# EAGLE design light-plate_all_v1.0 (EAGLE 6.2)

## Sheet 1 of 4
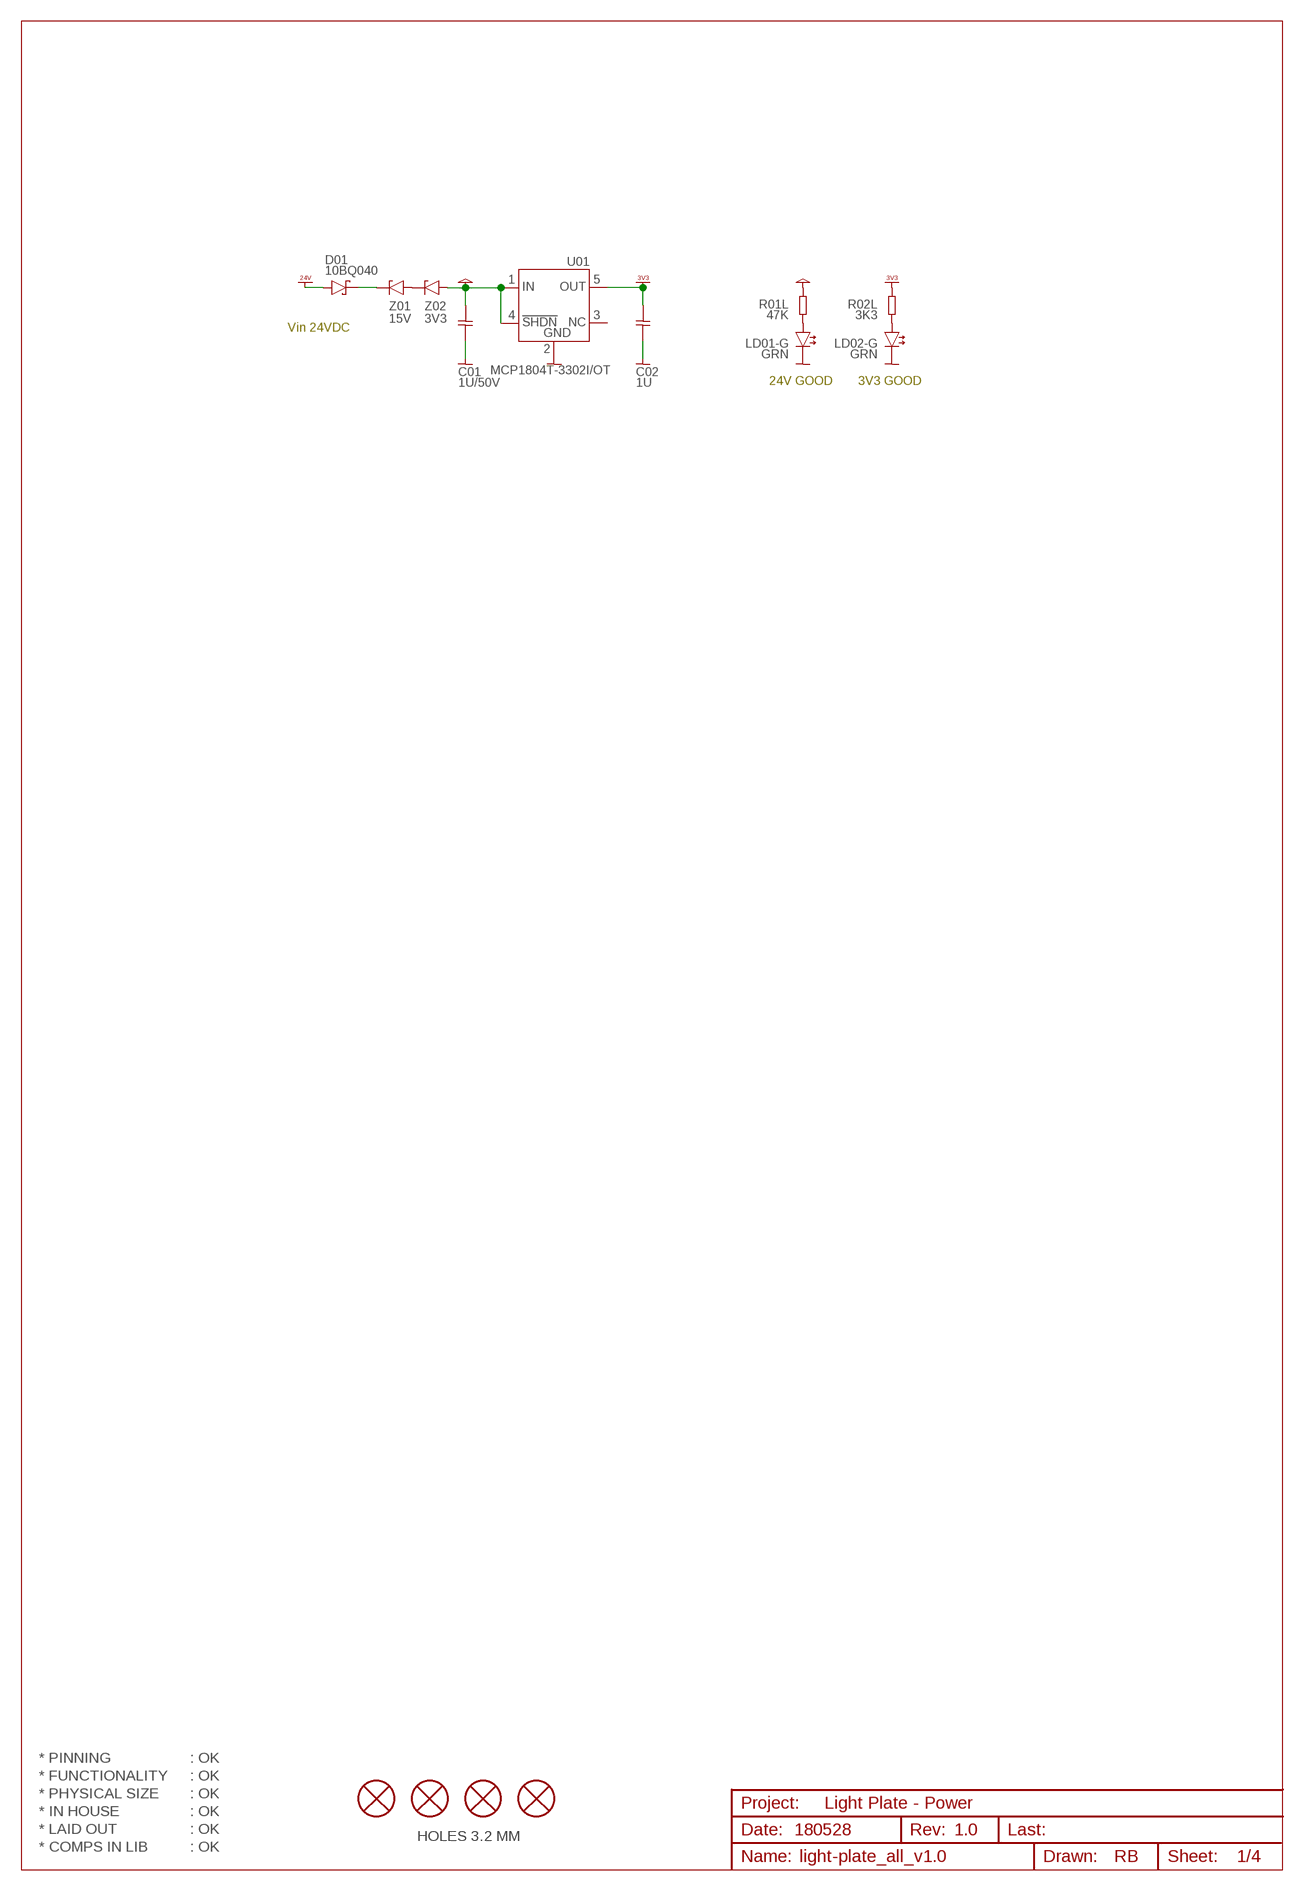
[diagram p0: schematic, sheet 1]

### Parts
C01  1U/50V  CAP0603  [CAP0603]
C02  1U  CAP0603  [CAP0603]
D01  10BQ040  DIODE_15MQ040  [DIODE_SMA]
H1  HOLE_3.2MM  [HOLE_PTH_3.2MM]
H2  HOLE_3.2MM  [HOLE_PTH_3.2MM]
H3  HOLE_3.2MM  [HOLE_PTH_3.2MM]
H4  HOLE_3.2MM  [HOLE_PTH_3.2MM]
LD01-G  GRN  LED_SMD_0603  [LED_SMD_0603]
LD02-G  GRN  LED_SMD_0603  [LED_SMD_0603]
R01L  47K  RES0603  [RES0603]
R02L  3K3  RES0603  [RES0603]
U01  MCP1804T-3302I/OT  [SOT23-5]
Z01  15V  ZENER_SOD80  [ZENER_SOD80]
Z02  3V3  ZENER_SOD80  [ZENER_SOD80]

### Nets
GND: C01.2 C02.2 LD01-G.C LD02-G.C U01.2(2.GND) ; also sheet 2,3,4
N$3: LD02-G.A R02L.2
N$25: LD01-G.A R01L.2
N$151: D01.C(-) Z01.2(-)
N$162: Z01.1(+) Z02.2(-)
VCC: C01.1 R01L.1 U01.1(1.IN) U01.4(4.SHDN) Z02.1(+)
VDD_3V3: C02.1 R02L.1 U01.5(5.OUT) ; supply symbol labelled VCC_3V3 ; also sheet 2
VDD_24V: D01.A(+) ; supply symbol labelled VCC_24V ; also sheet 2,3,4
Unconnected: H1.1 H2.1 H3.1 H4.1 U01.3(3.NC)

### Notes on the sheet
- Vin 24VDC
- 24V GOOD | 3V3 GOOD
- * PINNING | : OK
- * FUNCTIONALITY | : OK
- * PHYSICAL SIZE | : OK
- Light Plate - Power
- * IN HOUSE | : OK
- * LAID OUT | : OK | 180528 | 1.0
- HOLES 3.2 MM
- * COMPS IN LIB | : OK

## Sheet 2 of 4
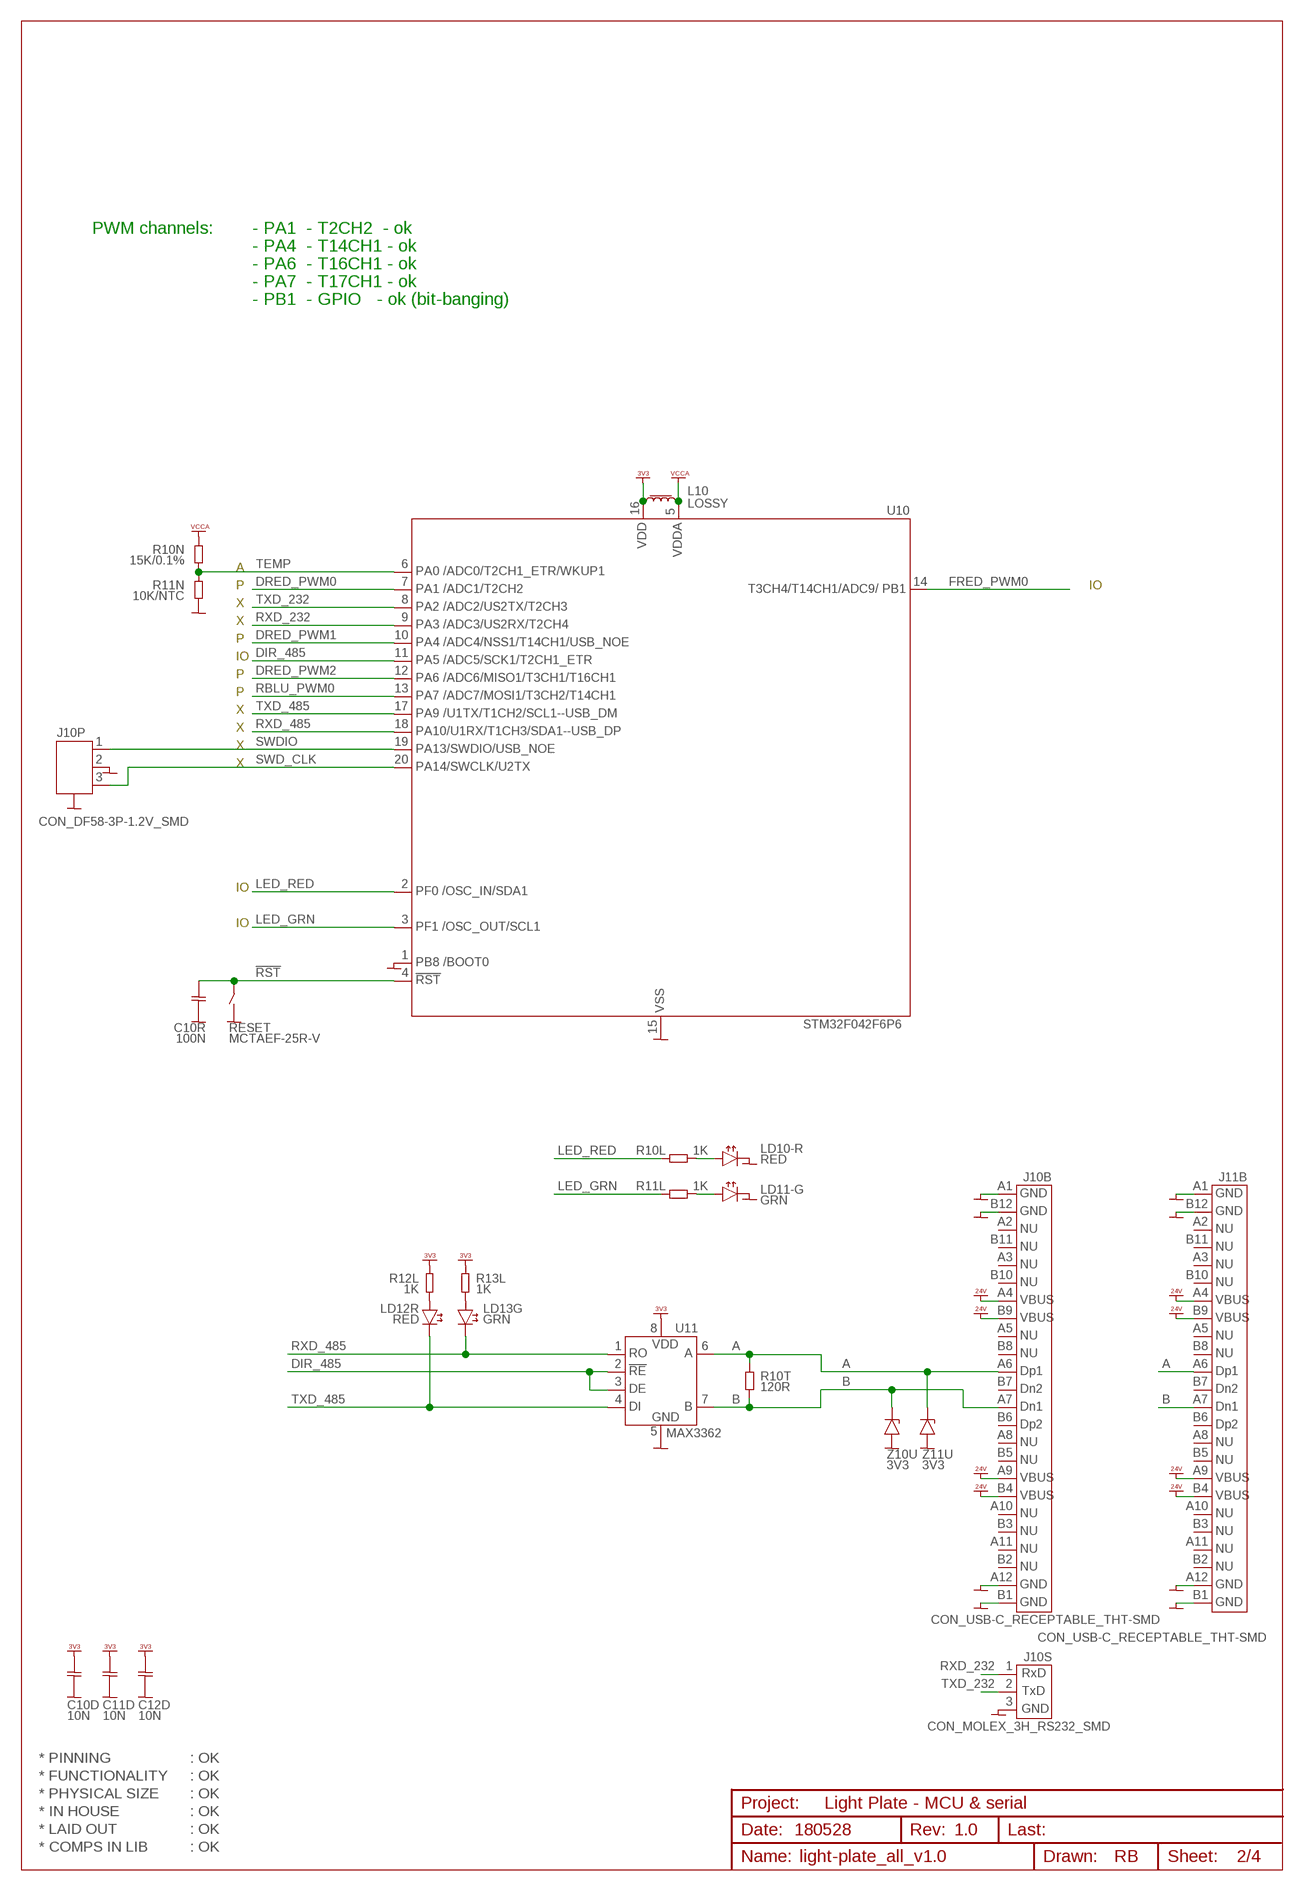
[diagram p1: schematic, sheet 2]

### Parts
C10D  10N  CAP0603  [CAP0603]
C10R  100N  CAP0603  [CAP0603]
C11D  10N  CAP0603  [CAP0603]
C12D  10N  CAP0603  [CAP0603]
J10B  CON_USB-C_RECEPTABLE_THT-SMD  [CON_USB-C_RECEPTABLE_THT-SMD]
J10P  CON_DF58-3P-1.2V_SMD  [CON_DF58-3P-1.2V_SMD]
J10S  CON_MOLEX_3H_RS232_SMD  [CON_MOLEX_3H+SMD]
J11B  CON_USB-C_RECEPTABLE_THT-SMD  [CON_USB-C_RECEPTABLE_THT-SMD]
L10  LOSSY  L_0603  [L_0603]
LD10-R  RED  LED_SMD_0603  [LED_SMD_0603]
LD11-G  GRN  LED_SMD_0603  [LED_SMD_0603]
LD12R  RED  LED_SMD_0603  [LED_SMD_0603]
LD13G  GRN  LED_SMD_0603  [LED_SMD_0603]
R10L  1K  RES0603  [RES0603]
R10N  15K/0.1%  RES0603  [RES0603]
R10T  120R  RES0603  [RES0603]
R11L  1K  RES0603  [RES0603]
R11N  10K/NTC  RES0603  [RES0603]
R12L  1K  RES0603  [RES0603]
R13L  1K  RES0603  [RES0603]
RESET  MCTAEF-25R-V  SWITCH_PUSHBUTTON  [SWITCH_SMD_PBUTTON_2P]
U10  STM32F042F6P6  [TSSOP20]
U11  MAX3362  [SOT23-8]
Z10U  3V3  ZENER_SOD80  [ZENER_SOD80]
Z11U  3V3  ZENER_SOD80  [ZENER_SOD80]

### Nets
!RST: C10R.1 RESET.2(3-4) U10.4(4.!RST)
A: J10B.A6(A6.DP1) J11B.A6(A6.DP1) R10T.1 U11.6(6.A) Z11U.2(-)
B: J10B.A7(A7.DN1) J11B.A7(A7.DN1) R10T.2 U11.7(7.B) Z10U.2(-)
DIR_485: U10.11(11.PA5) U11.2(2.!RE) U11.3(3.DE)
DRED_PWM0: U10.7(7.PA1) ; also sheet 3
DRED_PWM1: U10.10(10.PA4) ; also sheet 3
DRED_PWM2: U10.12(12.PA6) ; also sheet 3
FRED_PWM0: U10.14(14.PB1) ; also sheet 4
GND: C10D.2 C10R.2 C11D.2 C12D.2 J10B.A1(A1.GND) J10B.A12(A12.GND) J10B.B1(B1.GND) J10B.B12(B12.GND) J10P.2 J10P.GND1 J10P.GND2 J10S.3 J11B.A1(A1.GND) J11B.A12(A12.GND) J11B.B1(B1.GND) J11B.B12(B12.GND) LD10-R.C LD11-G.C R11N.1 RESET.1(1-2) U10.1(1.BOOT0) U10.15(15.GND) U11.5(5.GND) Z10U.1(+) Z11U.1(+) ; also sheet 1,3,4
LED_GRN: R11L.1 U10.3(3.OSC_OUT)
LED_RED: R10L.1 U10.2(2.OSC_IN)
N$148: LD11-G.A R11L.2
N$149: LD10-R.A R10L.2
N$152: LD13G.A R13L.2
N$153: LD12R.A R12L.2
RBLU_PWM0: U10.13(13.PA7) ; also sheet 4
RXD_232: J10S.1 U10.9(9.PA3)
RXD_485: LD13G.C U10.18(18.PA10) U11.1(1.RO)
SWD_CLK: J10P.3 U10.20(20.PA14)
SWDIO: J10P.1 U10.19(19.PA13)
TEMP: R10N.1 R11N.2 U10.6(6.PA0)
TXD_232: J10S.2 U10.8(8.PA2)
TXD_485: LD12R.C U10.17(17.PA9) U11.4(4.DI)
VCCA: L10.2 R10N.2 U10.5(5.VDDA)
VDD_3V3: C10D.1 C11D.1 C12D.1 L10.1 R12L.1 R13L.1 U10.16(16.VDD) U11.8(8.VDD) ; supply symbol labelled VCC_3V3 ; also sheet 1
VDD_24V: J10B.A4(A4.VBUS) J10B.A9(A9.VBUS) J10B.B4(B4.VBUS) J10B.B9(B9.VBUS) J11B.A4(A4.VBUS) J11B.A9(A9.VBUS) J11B.B4(B4.VBUS) J11B.B9(B9.VBUS) ; supply symbol labelled VCC_24V ; also sheet 1,3,4
Unconnected: J10B.A2(A2.NU) J10B.A3(A3.NU) J10B.A5(A5.NU) J10B.A8(A8.NU) J10B.A10(A10.NU) J10B.A11(A11.NU) J10B.B2(B2.NU) J10B.B3(B3.NU) J10B.B5(B5.NU) J10B.B6(B6.DP2) J10B.B7(B7.DN2) J10B.B8(B8.NU) J10B.B10(B10.NU) J10B.B11(B11.NU) J11B.A2(A2.NU) J11B.A3(A3.NU) J11B.A5(A5.NU) J11B.A8(A8.NU) J11B.A10(A10.NU) J11B.A11(A11.NU) J11B.B2(B2.NU) J11B.B3(B3.NU) J11B.B5(B5.NU) J11B.B6(B6.DP2) J11B.B7(B7.DN2) J11B.B8(B8.NU) J11B.B10(B10.NU) J11B.B11(B11.NU)

### Notes on the sheet
- PWM channels: | - PA1  - T2CH2  - ok
- - PA4  - T14CH1 - ok
- - PA6  - T16CH1 - ok
- - PA7  - T17CH1 - ok
- - PB1  - GPIO   - ok (bit-banging)
- A
- P | IO
- X
- X
- P
- IO
- P
- P
- X
- X
- X
- X
- IO
- IO
- * PINNING | : OK
- * FUNCTIONALITY | : OK
- * PHYSICAL SIZE | : OK
- Light Plate - MCU & serial
- * IN HOUSE | : OK
- * LAID OUT | : OK | 180528 | 1.0
- * COMPS IN LIB | : OK

## Sheet 3 of 4
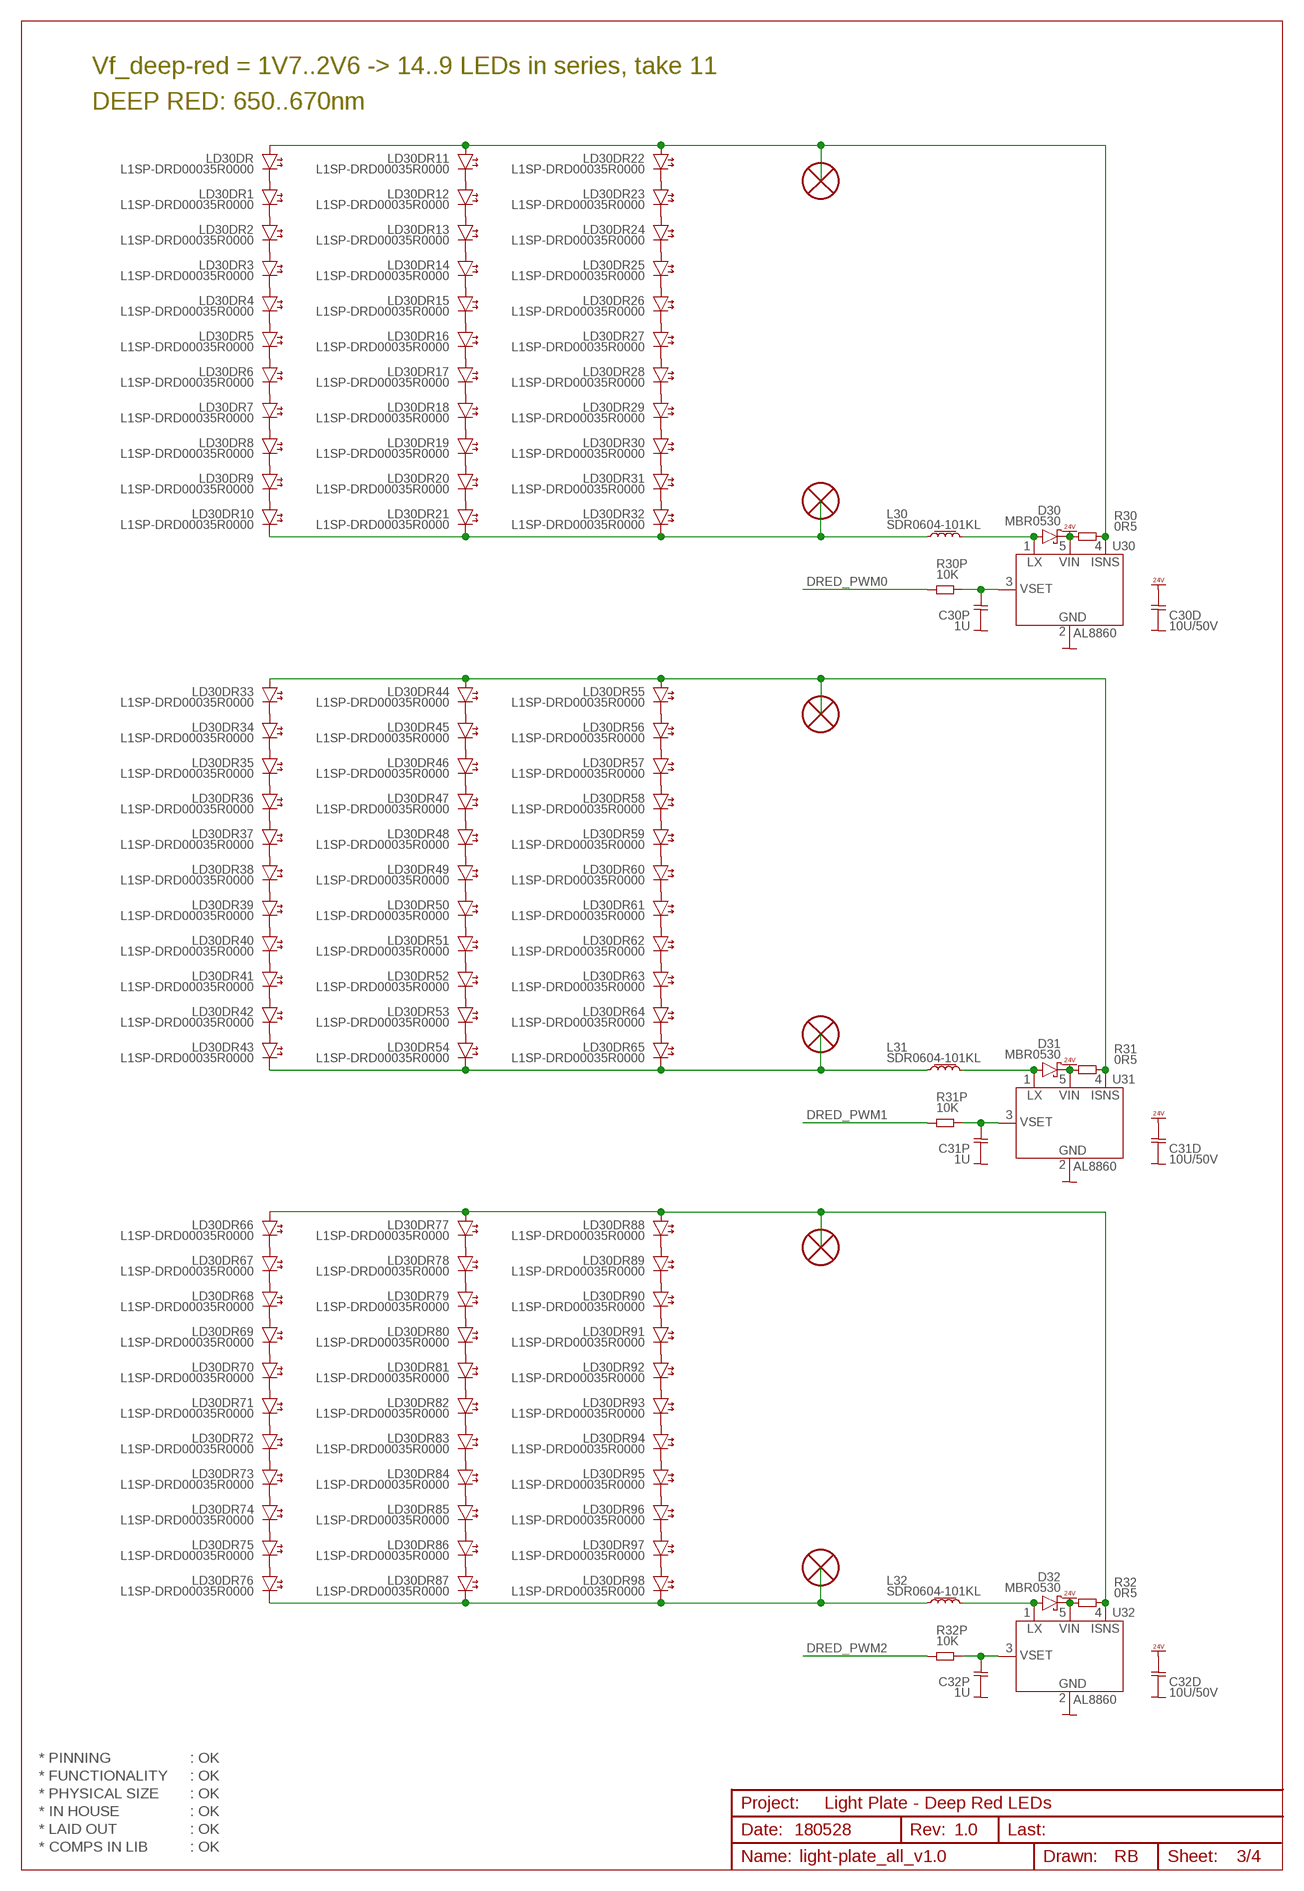
[diagram p2: schematic, sheet 3]

### Parts
C30D  10U/50V  CAP0603  [CAP0603]
C30P  1U  CAP0603  [CAP0603]
C31D  10U/50V  CAP0603  [CAP0603]
C31P  1U  CAP0603  [CAP0603]
C32D  10U/50V  CAP0603  [CAP0603]
C32P  1U  CAP0603  [CAP0603]
D30  MBR0530  DIODE_MBR0530  [DIODE_SOD123]
D31  MBR0530  DIODE_MBR0530  [DIODE_SOD123]
D32  MBR0530  DIODE_MBR0530  [DIODE_SOD123]
H5  HOLE_PTH_1.0MM  [HOLE_PTH_1.0MM]
H6  HOLE_PTH_1.0MM  [HOLE_PTH_1.0MM]
H7  HOLE_PTH_1.0MM  [HOLE_PTH_1.0MM]
H8  HOLE_PTH_1.0MM  [HOLE_PTH_1.0MM]
H9  HOLE_PTH_1.0MM  [HOLE_PTH_1.0MM]
H10  HOLE_PTH_1.0MM  [HOLE_PTH_1.0MM]
L30  SDR0604-101KL  L_SDR0604  [L_SDR0604]
L31  SDR0604-101KL  L_SDR0604  [L_SDR0604]
L32  SDR0604-101KL  L_SDR0604  [L_SDR0604]
LD30DR  L1SP-DRD00035R0000  LED_SMD_SUNPLUS35_REVERSED  [LED_SMD_SUNPLUS35_REVERSED]
LD30DR1  L1SP-DRD00035R0000  LED_SMD_SUNPLUS35_REVERSED  [LED_SMD_SUNPLUS35_REVERSED]
LD30DR2  L1SP-DRD00035R0000  LED_SMD_SUNPLUS35_REVERSED  [LED_SMD_SUNPLUS35_REVERSED]
LD30DR3  L1SP-DRD00035R0000  LED_SMD_SUNPLUS35_REVERSED  [LED_SMD_SUNPLUS35_REVERSED]
LD30DR4  L1SP-DRD00035R0000  LED_SMD_SUNPLUS35_REVERSED  [LED_SMD_SUNPLUS35_REVERSED]
LD30DR5  L1SP-DRD00035R0000  LED_SMD_SUNPLUS35_REVERSED  [LED_SMD_SUNPLUS35_REVERSED]
LD30DR6  L1SP-DRD00035R0000  LED_SMD_SUNPLUS35_REVERSED  [LED_SMD_SUNPLUS35_REVERSED]
LD30DR7  L1SP-DRD00035R0000  LED_SMD_SUNPLUS35_REVERSED  [LED_SMD_SUNPLUS35_REVERSED]
LD30DR8  L1SP-DRD00035R0000  LED_SMD_SUNPLUS35_REVERSED  [LED_SMD_SUNPLUS35_REVERSED]
LD30DR9  L1SP-DRD00035R0000  LED_SMD_SUNPLUS35_REVERSED  [LED_SMD_SUNPLUS35_REVERSED]
LD30DR10  L1SP-DRD00035R0000  LED_SMD_SUNPLUS35_REVERSED  [LED_SMD_SUNPLUS35_REVERSED]
LD30DR11  L1SP-DRD00035R0000  LED_SMD_SUNPLUS35_REVERSED  [LED_SMD_SUNPLUS35_REVERSED]
LD30DR12  L1SP-DRD00035R0000  LED_SMD_SUNPLUS35_REVERSED  [LED_SMD_SUNPLUS35_REVERSED]
LD30DR13  L1SP-DRD00035R0000  LED_SMD_SUNPLUS35_REVERSED  [LED_SMD_SUNPLUS35_REVERSED]
LD30DR14  L1SP-DRD00035R0000  LED_SMD_SUNPLUS35_REVERSED  [LED_SMD_SUNPLUS35_REVERSED]
LD30DR15  L1SP-DRD00035R0000  LED_SMD_SUNPLUS35_REVERSED  [LED_SMD_SUNPLUS35_REVERSED]
LD30DR16  L1SP-DRD00035R0000  LED_SMD_SUNPLUS35_REVERSED  [LED_SMD_SUNPLUS35_REVERSED]
LD30DR17  L1SP-DRD00035R0000  LED_SMD_SUNPLUS35_REVERSED  [LED_SMD_SUNPLUS35_REVERSED]
LD30DR18  L1SP-DRD00035R0000  LED_SMD_SUNPLUS35_REVERSED  [LED_SMD_SUNPLUS35_REVERSED]
LD30DR19  L1SP-DRD00035R0000  LED_SMD_SUNPLUS35_REVERSED  [LED_SMD_SUNPLUS35_REVERSED]
LD30DR20  L1SP-DRD00035R0000  LED_SMD_SUNPLUS35_REVERSED  [LED_SMD_SUNPLUS35_REVERSED]
LD30DR21  L1SP-DRD00035R0000  LED_SMD_SUNPLUS35_REVERSED  [LED_SMD_SUNPLUS35_REVERSED]
LD30DR22  L1SP-DRD00035R0000  LED_SMD_SUNPLUS35_REVERSED  [LED_SMD_SUNPLUS35_REVERSED]
LD30DR23  L1SP-DRD00035R0000  LED_SMD_SUNPLUS35_REVERSED  [LED_SMD_SUNPLUS35_REVERSED]
LD30DR24  L1SP-DRD00035R0000  LED_SMD_SUNPLUS35_REVERSED  [LED_SMD_SUNPLUS35_REVERSED]
LD30DR25  L1SP-DRD00035R0000  LED_SMD_SUNPLUS35_REVERSED  [LED_SMD_SUNPLUS35_REVERSED]
LD30DR26  L1SP-DRD00035R0000  LED_SMD_SUNPLUS35_REVERSED  [LED_SMD_SUNPLUS35_REVERSED]
LD30DR27  L1SP-DRD00035R0000  LED_SMD_SUNPLUS35_REVERSED  [LED_SMD_SUNPLUS35_REVERSED]
LD30DR28  L1SP-DRD00035R0000  LED_SMD_SUNPLUS35_REVERSED  [LED_SMD_SUNPLUS35_REVERSED]
LD30DR29  L1SP-DRD00035R0000  LED_SMD_SUNPLUS35_REVERSED  [LED_SMD_SUNPLUS35_REVERSED]
LD30DR30  L1SP-DRD00035R0000  LED_SMD_SUNPLUS35_REVERSED  [LED_SMD_SUNPLUS35_REVERSED]
LD30DR31  L1SP-DRD00035R0000  LED_SMD_SUNPLUS35_REVERSED  [LED_SMD_SUNPLUS35_REVERSED]
LD30DR32  L1SP-DRD00035R0000  LED_SMD_SUNPLUS35_REVERSED  [LED_SMD_SUNPLUS35_REVERSED]
LD30DR33  L1SP-DRD00035R0000  LED_SMD_SUNPLUS35_REVERSED  [LED_SMD_SUNPLUS35_REVERSED]
LD30DR34  L1SP-DRD00035R0000  LED_SMD_SUNPLUS35_REVERSED  [LED_SMD_SUNPLUS35_REVERSED]
LD30DR35  L1SP-DRD00035R0000  LED_SMD_SUNPLUS35_REVERSED  [LED_SMD_SUNPLUS35_REVERSED]
LD30DR36  L1SP-DRD00035R0000  LED_SMD_SUNPLUS35_REVERSED  [LED_SMD_SUNPLUS35_REVERSED]
LD30DR37  L1SP-DRD00035R0000  LED_SMD_SUNPLUS35_REVERSED  [LED_SMD_SUNPLUS35_REVERSED]
LD30DR38  L1SP-DRD00035R0000  LED_SMD_SUNPLUS35_REVERSED  [LED_SMD_SUNPLUS35_REVERSED]
LD30DR39  L1SP-DRD00035R0000  LED_SMD_SUNPLUS35_REVERSED  [LED_SMD_SUNPLUS35_REVERSED]
LD30DR40  L1SP-DRD00035R0000  LED_SMD_SUNPLUS35_REVERSED  [LED_SMD_SUNPLUS35_REVERSED]
LD30DR41  L1SP-DRD00035R0000  LED_SMD_SUNPLUS35_REVERSED  [LED_SMD_SUNPLUS35_REVERSED]
LD30DR42  L1SP-DRD00035R0000  LED_SMD_SUNPLUS35_REVERSED  [LED_SMD_SUNPLUS35_REVERSED]
LD30DR43  L1SP-DRD00035R0000  LED_SMD_SUNPLUS35_REVERSED  [LED_SMD_SUNPLUS35_REVERSED]
LD30DR44  L1SP-DRD00035R0000  LED_SMD_SUNPLUS35_REVERSED  [LED_SMD_SUNPLUS35_REVERSED]
LD30DR45  L1SP-DRD00035R0000  LED_SMD_SUNPLUS35_REVERSED  [LED_SMD_SUNPLUS35_REVERSED]
LD30DR46  L1SP-DRD00035R0000  LED_SMD_SUNPLUS35_REVERSED  [LED_SMD_SUNPLUS35_REVERSED]
LD30DR47  L1SP-DRD00035R0000  LED_SMD_SUNPLUS35_REVERSED  [LED_SMD_SUNPLUS35_REVERSED]
LD30DR48  L1SP-DRD00035R0000  LED_SMD_SUNPLUS35_REVERSED  [LED_SMD_SUNPLUS35_REVERSED]
LD30DR49  L1SP-DRD00035R0000  LED_SMD_SUNPLUS35_REVERSED  [LED_SMD_SUNPLUS35_REVERSED]
LD30DR50  L1SP-DRD00035R0000  LED_SMD_SUNPLUS35_REVERSED  [LED_SMD_SUNPLUS35_REVERSED]
LD30DR51  L1SP-DRD00035R0000  LED_SMD_SUNPLUS35_REVERSED  [LED_SMD_SUNPLUS35_REVERSED]
LD30DR52  L1SP-DRD00035R0000  LED_SMD_SUNPLUS35_REVERSED  [LED_SMD_SUNPLUS35_REVERSED]
LD30DR53  L1SP-DRD00035R0000  LED_SMD_SUNPLUS35_REVERSED  [LED_SMD_SUNPLUS35_REVERSED]
LD30DR54  L1SP-DRD00035R0000  LED_SMD_SUNPLUS35_REVERSED  [LED_SMD_SUNPLUS35_REVERSED]
LD30DR55  L1SP-DRD00035R0000  LED_SMD_SUNPLUS35_REVERSED  [LED_SMD_SUNPLUS35_REVERSED]
LD30DR56  L1SP-DRD00035R0000  LED_SMD_SUNPLUS35_REVERSED  [LED_SMD_SUNPLUS35_REVERSED]
LD30DR57  L1SP-DRD00035R0000  LED_SMD_SUNPLUS35_REVERSED  [LED_SMD_SUNPLUS35_REVERSED]
LD30DR58  L1SP-DRD00035R0000  LED_SMD_SUNPLUS35_REVERSED  [LED_SMD_SUNPLUS35_REVERSED]
LD30DR59  L1SP-DRD00035R0000  LED_SMD_SUNPLUS35_REVERSED  [LED_SMD_SUNPLUS35_REVERSED]
LD30DR60  L1SP-DRD00035R0000  LED_SMD_SUNPLUS35_REVERSED  [LED_SMD_SUNPLUS35_REVERSED]
LD30DR61  L1SP-DRD00035R0000  LED_SMD_SUNPLUS35_REVERSED  [LED_SMD_SUNPLUS35_REVERSED]
LD30DR62  L1SP-DRD00035R0000  LED_SMD_SUNPLUS35_REVERSED  [LED_SMD_SUNPLUS35_REVERSED]
LD30DR63  L1SP-DRD00035R0000  LED_SMD_SUNPLUS35_REVERSED  [LED_SMD_SUNPLUS35_REVERSED]
LD30DR64  L1SP-DRD00035R0000  LED_SMD_SUNPLUS35_REVERSED  [LED_SMD_SUNPLUS35_REVERSED]
LD30DR65  L1SP-DRD00035R0000  LED_SMD_SUNPLUS35_REVERSED  [LED_SMD_SUNPLUS35_REVERSED]
LD30DR66  L1SP-DRD00035R0000  LED_SMD_SUNPLUS35_REVERSED  [LED_SMD_SUNPLUS35_REVERSED]
LD30DR67  L1SP-DRD00035R0000  LED_SMD_SUNPLUS35_REVERSED  [LED_SMD_SUNPLUS35_REVERSED]
LD30DR68  L1SP-DRD00035R0000  LED_SMD_SUNPLUS35_REVERSED  [LED_SMD_SUNPLUS35_REVERSED]
LD30DR69  L1SP-DRD00035R0000  LED_SMD_SUNPLUS35_REVERSED  [LED_SMD_SUNPLUS35_REVERSED]
LD30DR70  L1SP-DRD00035R0000  LED_SMD_SUNPLUS35_REVERSED  [LED_SMD_SUNPLUS35_REVERSED]
LD30DR71  L1SP-DRD00035R0000  LED_SMD_SUNPLUS35_REVERSED  [LED_SMD_SUNPLUS35_REVERSED]
LD30DR72  L1SP-DRD00035R0000  LED_SMD_SUNPLUS35_REVERSED  [LED_SMD_SUNPLUS35_REVERSED]
LD30DR73  L1SP-DRD00035R0000  LED_SMD_SUNPLUS35_REVERSED  [LED_SMD_SUNPLUS35_REVERSED]
LD30DR74  L1SP-DRD00035R0000  LED_SMD_SUNPLUS35_REVERSED  [LED_SMD_SUNPLUS35_REVERSED]
LD30DR75  L1SP-DRD00035R0000  LED_SMD_SUNPLUS35_REVERSED  [LED_SMD_SUNPLUS35_REVERSED]
LD30DR76  L1SP-DRD00035R0000  LED_SMD_SUNPLUS35_REVERSED  [LED_SMD_SUNPLUS35_REVERSED]
LD30DR77  L1SP-DRD00035R0000  LED_SMD_SUNPLUS35_REVERSED  [LED_SMD_SUNPLUS35_REVERSED]
LD30DR78  L1SP-DRD00035R0000  LED_SMD_SUNPLUS35_REVERSED  [LED_SMD_SUNPLUS35_REVERSED]
LD30DR79  L1SP-DRD00035R0000  LED_SMD_SUNPLUS35_REVERSED  [LED_SMD_SUNPLUS35_REVERSED]
LD30DR80  L1SP-DRD00035R0000  LED_SMD_SUNPLUS35_REVERSED  [LED_SMD_SUNPLUS35_REVERSED]
LD30DR81  L1SP-DRD00035R0000  LED_SMD_SUNPLUS35_REVERSED  [LED_SMD_SUNPLUS35_REVERSED]
LD30DR82  L1SP-DRD00035R0000  LED_SMD_SUNPLUS35_REVERSED  [LED_SMD_SUNPLUS35_REVERSED]
LD30DR83  L1SP-DRD00035R0000  LED_SMD_SUNPLUS35_REVERSED  [LED_SMD_SUNPLUS35_REVERSED]
LD30DR84  L1SP-DRD00035R0000  LED_SMD_SUNPLUS35_REVERSED  [LED_SMD_SUNPLUS35_REVERSED]
LD30DR85  L1SP-DRD00035R0000  LED_SMD_SUNPLUS35_REVERSED  [LED_SMD_SUNPLUS35_REVERSED]
LD30DR86  L1SP-DRD00035R0000  LED_SMD_SUNPLUS35_REVERSED  [LED_SMD_SUNPLUS35_REVERSED]
LD30DR87  L1SP-DRD00035R0000  LED_SMD_SUNPLUS35_REVERSED  [LED_SMD_SUNPLUS35_REVERSED]
LD30DR88  L1SP-DRD00035R0000  LED_SMD_SUNPLUS35_REVERSED  [LED_SMD_SUNPLUS35_REVERSED]
LD30DR89  L1SP-DRD00035R0000  LED_SMD_SUNPLUS35_REVERSED  [LED_SMD_SUNPLUS35_REVERSED]
LD30DR90  L1SP-DRD00035R0000  LED_SMD_SUNPLUS35_REVERSED  [LED_SMD_SUNPLUS35_REVERSED]
LD30DR91  L1SP-DRD00035R0000  LED_SMD_SUNPLUS35_REVERSED  [LED_SMD_SUNPLUS35_REVERSED]
LD30DR92  L1SP-DRD00035R0000  LED_SMD_SUNPLUS35_REVERSED  [LED_SMD_SUNPLUS35_REVERSED]
LD30DR93  L1SP-DRD00035R0000  LED_SMD_SUNPLUS35_REVERSED  [LED_SMD_SUNPLUS35_REVERSED]
LD30DR94  L1SP-DRD00035R0000  LED_SMD_SUNPLUS35_REVERSED  [LED_SMD_SUNPLUS35_REVERSED]
LD30DR95  L1SP-DRD00035R0000  LED_SMD_SUNPLUS35_REVERSED  [LED_SMD_SUNPLUS35_REVERSED]
LD30DR96  L1SP-DRD00035R0000  LED_SMD_SUNPLUS35_REVERSED  [LED_SMD_SUNPLUS35_REVERSED]
LD30DR97  L1SP-DRD00035R0000  LED_SMD_SUNPLUS35_REVERSED  [LED_SMD_SUNPLUS35_REVERSED]
LD30DR98  L1SP-DRD00035R0000  LED_SMD_SUNPLUS35_REVERSED  [LED_SMD_SUNPLUS35_REVERSED]
R30  0R5  RES0603  [RES0603]
R30P  10K  RES0603  [RES0603]
R31  0R5  RES0603  [RES0603]
R31P  10K  RES0603  [RES0603]
R32  0R5  RES0603  [RES0603]
R32P  10K  RES0603  [RES0603]
U30  AL8860  [SOT23-5]
U31  AL8860  [SOT23-5]
U32  AL8860  [SOT23-5]

### Nets
DRED_PWM0: R30P.1 ; also sheet 2
DRED_PWM1: R31P.1 ; also sheet 2
DRED_PWM2: R32P.1 ; also sheet 2
GND: C30D.2 C30P.2 C31D.2 C31P.2 C32D.2 C32P.2 U30.2(2.GND) U31.2(2.GND) U32.2(2.GND) ; also sheet 1,2,4
N$12: C30P.1 R30P.2 U30.3(3.VSET)
N$15: LD30DR1.C(+) LD30DR.A(-)
N$16: LD30DR1.A(-) LD30DR2.C(+)
N$17: LD30DR2.A(-) LD30DR3.C(+)
N$18: LD30DR3.A(-) LD30DR4.C(+)
N$19: LD30DR4.A(-) LD30DR5.C(+)
N$20: LD30DR5.A(-) LD30DR6.C(+)
N$21: LD30DR6.A(-) LD30DR7.C(+)
N$22: LD30DR7.A(-) LD30DR8.C(+)
N$23: LD30DR8.A(-) LD30DR9.C(+)
N$24: LD30DR9.A(-) LD30DR10.C(+)
N$26: LD30DR11.A(-) LD30DR12.C(+)
N$27: LD30DR12.A(-) LD30DR13.C(+)
N$28: LD30DR13.A(-) LD30DR14.C(+)
N$29: LD30DR14.A(-) LD30DR15.C(+)
N$30: LD30DR15.A(-) LD30DR16.C(+)
N$31: LD30DR16.A(-) LD30DR17.C(+)
N$32: LD30DR17.A(-) LD30DR18.C(+)
N$33: LD30DR18.A(-) LD30DR19.C(+)
N$34: LD30DR19.A(-) LD30DR20.C(+)
N$35: LD30DR20.A(-) LD30DR21.C(+)
N$36: LD30DR22.A(-) LD30DR23.C(+)
N$37: LD30DR23.A(-) LD30DR24.C(+)
N$38: LD30DR24.A(-) LD30DR25.C(+)
N$39: LD30DR25.A(-) LD30DR26.C(+)
N$40: LD30DR26.A(-) LD30DR27.C(+)
N$41: LD30DR27.A(-) LD30DR28.C(+)
N$42: LD30DR28.A(-) LD30DR29.C(+)
N$43: LD30DR29.A(-) LD30DR30.C(+)
N$44: LD30DR30.A(-) LD30DR31.C(+)
N$45: LD30DR31.A(-) LD30DR32.C(+)
N$46: LD30DR33.A(-) LD30DR34.C(+)
N$47: LD30DR34.A(-) LD30DR35.C(+)
N$48: LD30DR35.A(-) LD30DR36.C(+)
N$49: LD30DR36.A(-) LD30DR37.C(+)
N$50: LD30DR37.A(-) LD30DR38.C(+)
N$51: LD30DR38.A(-) LD30DR39.C(+)
N$52: LD30DR39.A(-) LD30DR40.C(+)
N$53: LD30DR40.A(-) LD30DR41.C(+)
N$54: LD30DR41.A(-) LD30DR42.C(+)
N$55: LD30DR42.A(-) LD30DR43.C(+)
N$56: LD30DR44.A(-) LD30DR45.C(+)
N$57: LD30DR45.A(-) LD30DR46.C(+)
N$58: LD30DR46.A(-) LD30DR47.C(+)
N$59: LD30DR47.A(-) LD30DR48.C(+)
N$60: LD30DR48.A(-) LD30DR49.C(+)
N$61: LD30DR49.A(-) LD30DR50.C(+)
N$62: LD30DR50.A(-) LD30DR51.C(+)
N$63: LD30DR51.A(-) LD30DR52.C(+)
N$64: LD30DR52.A(-) LD30DR53.C(+)
N$65: LD30DR53.A(-) LD30DR54.C(+)
N$66: LD30DR55.A(-) LD30DR56.C(+)
N$67: LD30DR56.A(-) LD30DR57.C(+)
N$68: LD30DR57.A(-) LD30DR58.C(+)
N$69: LD30DR58.A(-) LD30DR59.C(+)
N$70: LD30DR59.A(-) LD30DR60.C(+)
N$71: LD30DR60.A(-) LD30DR61.C(+)
N$72: LD30DR61.A(-) LD30DR62.C(+)
N$73: LD30DR62.A(-) LD30DR63.C(+)
N$74: LD30DR63.A(-) LD30DR64.C(+)
N$75: LD30DR64.A(-) LD30DR65.C(+)
N$76: LD30DR66.A(-) LD30DR67.C(+)
N$77: LD30DR67.A(-) LD30DR68.C(+)
N$78: LD30DR68.A(-) LD30DR69.C(+)
N$79: LD30DR69.A(-) LD30DR70.C(+)
N$80: LD30DR70.A(-) LD30DR71.C(+)
N$81: LD30DR71.A(-) LD30DR72.C(+)
N$82: LD30DR72.A(-) LD30DR73.C(+)
N$83: LD30DR73.A(-) LD30DR74.C(+)
N$84: LD30DR74.A(-) LD30DR75.C(+)
N$85: LD30DR75.A(-) LD30DR76.C(+)
N$86: LD30DR77.A(-) LD30DR78.C(+)
N$87: LD30DR78.A(-) LD30DR79.C(+)
N$88: LD30DR79.A(-) LD30DR80.C(+)
N$89: LD30DR80.A(-) LD30DR81.C(+)
N$90: LD30DR81.A(-) LD30DR82.C(+)
N$91: LD30DR82.A(-) LD30DR83.C(+)
N$92: LD30DR83.A(-) LD30DR84.C(+)
N$93: LD30DR84.A(-) LD30DR85.C(+)
N$94: LD30DR85.A(-) LD30DR86.C(+)
N$95: LD30DR86.A(-) LD30DR87.C(+)
N$96: LD30DR88.A(-) LD30DR89.C(+)
N$97: LD30DR89.A(-) LD30DR90.C(+)
N$98: LD30DR90.A(-) LD30DR91.C(+)
N$99: LD30DR91.A(-) LD30DR92.C(+)
N$100: LD30DR92.A(-) LD30DR93.C(+)
N$101: LD30DR93.A(-) LD30DR94.C(+)
N$102: LD30DR94.A(-) LD30DR95.C(+)
N$103: LD30DR95.A(-) LD30DR96.C(+)
N$104: LD30DR96.A(-) LD30DR97.C(+)
N$105: LD30DR97.A(-) LD30DR98.C(+)
N$138: H5.1 L30.1 LD30DR10.A(-) LD30DR21.A(-) LD30DR32.A(-)
N$139: H8.1 LD30DR33.C(+) LD30DR44.C(+) LD30DR55.C(+) R31.2 U31.4(4.ISENSE)
N$140: D30.2(+) L30.2 U30.1(1.LX)
N$141: H6.1 LD30DR11.C(+) LD30DR22.C(+) LD30DR.C(+) R30.2 U30.4(4.ISENSE)
N$142: H7.1 L31.1 LD30DR43.A(-) LD30DR54.A(-) LD30DR65.A(-)
N$143: H10.1 LD30DR66.C(+) LD30DR77.C(+) LD30DR88.C(+) R32.2 U32.4(4.ISENSE)
N$144: H9.1 L32.1 LD30DR76.A(-) LD30DR87.A(-) LD30DR98.A(-)
N$147: D31.2(+) L31.2 U31.1(1.LX)
N$154: C31P.1 R31P.2 U31.3(3.VSET)
N$155: D32.2(+) L32.2 U32.1(1.LX)
N$156: C32P.1 R32P.2 U32.3(3.VSET)
VDD_24V: C30D.1 C31D.1 C32D.1 D30.1-(-) D31.1-(-) D32.1-(-) R30.1 R31.1 R32.1 U30.5(5.VIN) U31.5(5.VIN) U32.5(5.VIN) ; supply symbol labelled VCC_24V ; also sheet 1,2,4

### Notes on the sheet
- Vf_deep-red = 1V7..2V6 -> 14..9 LEDs in series, take 11
- DEEP RED: 650..670nm
- * PINNING | : OK
- * FUNCTIONALITY | : OK
- * PHYSICAL SIZE | : OK
- Light Plate - Deep Red LEDs
- * IN HOUSE | : OK
- * LAID OUT | : OK | 180528 | 1.0
- * COMPS IN LIB | : OK

## Sheet 4 of 4
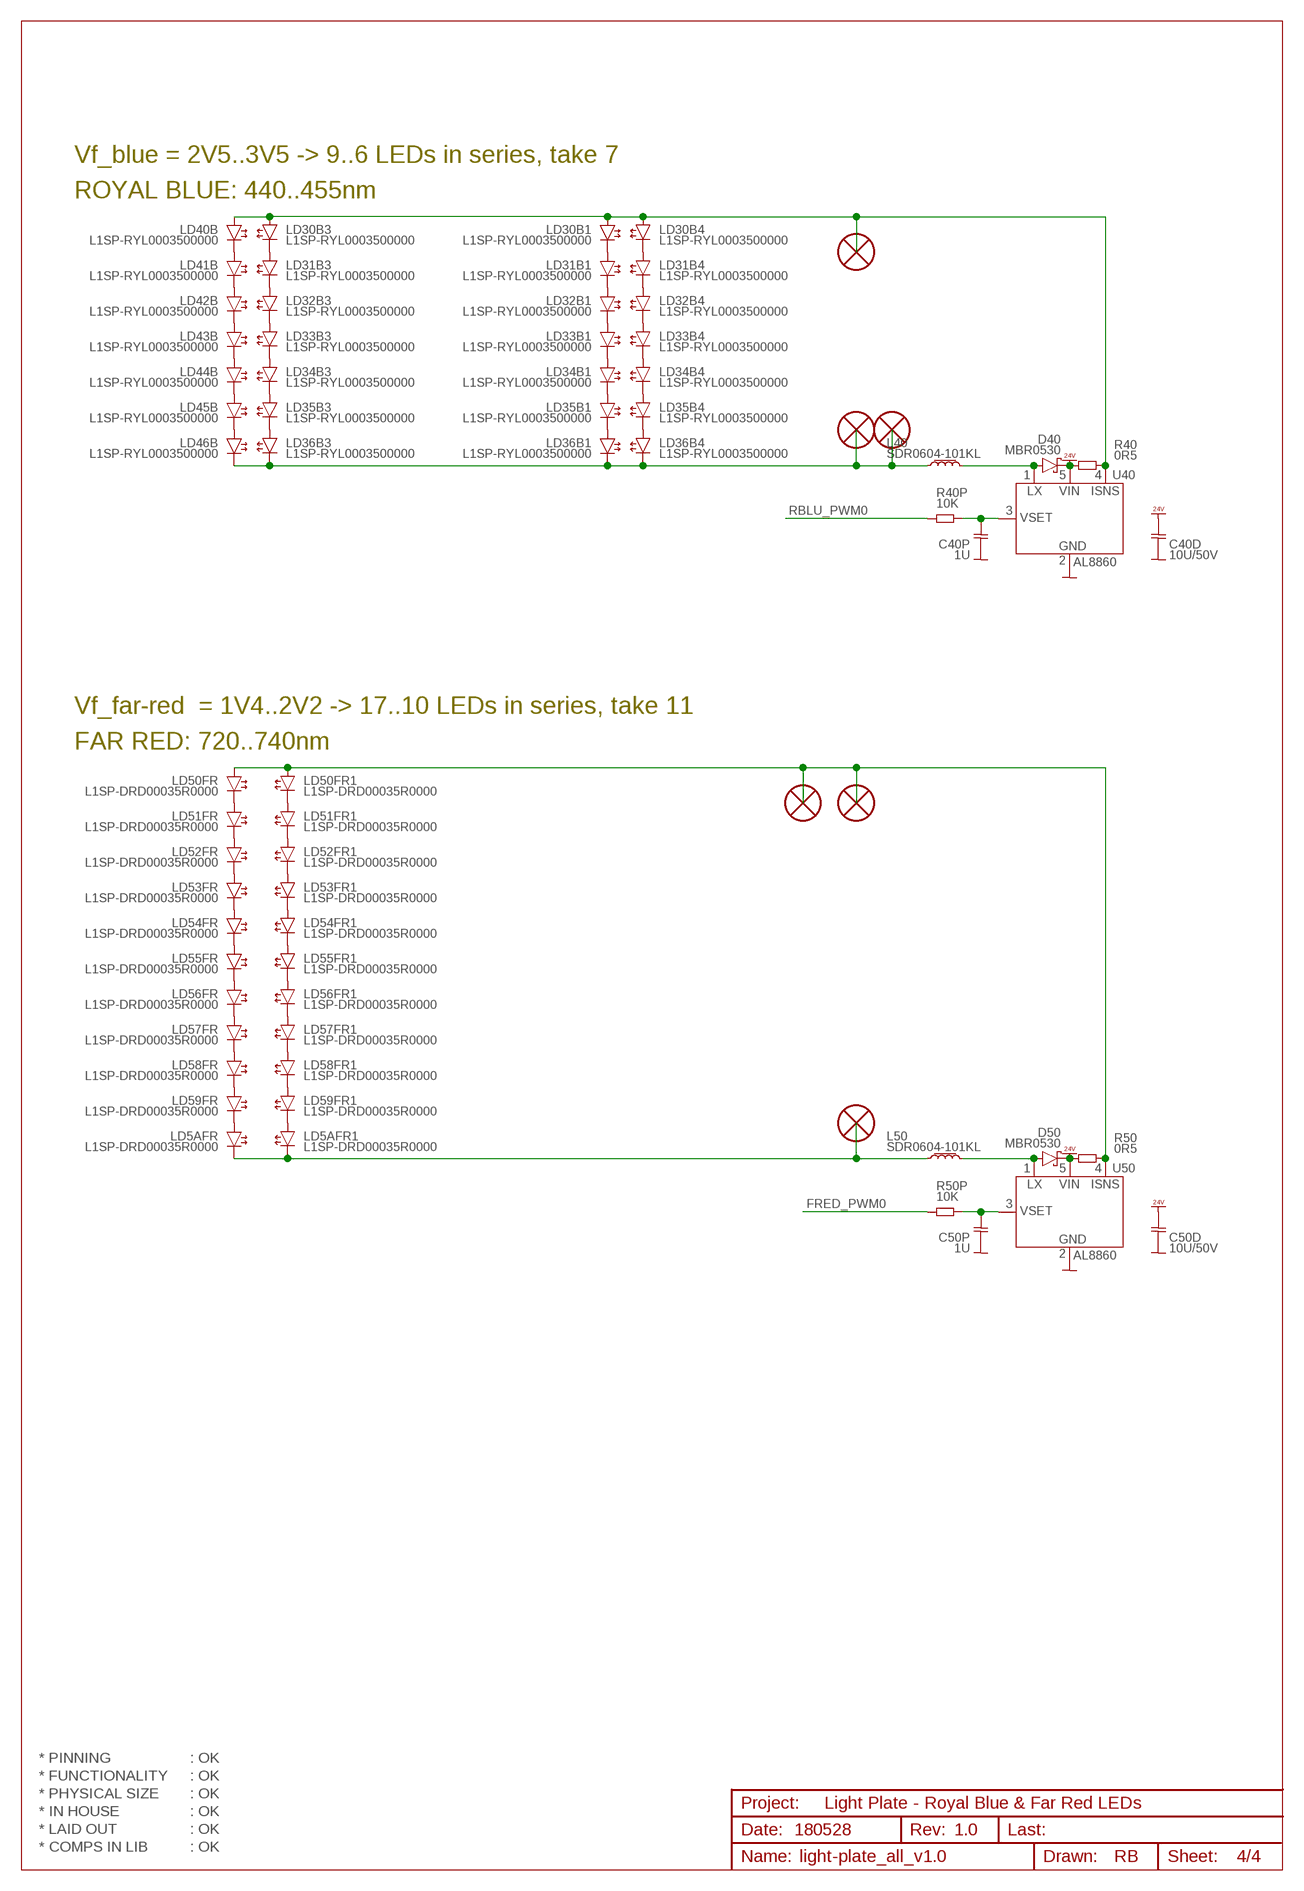
[diagram p3: schematic, sheet 4]

### Parts
C40D  10U/50V  CAP0603  [CAP0603]
C40P  1U  CAP0603  [CAP0603]
C50D  10U/50V  CAP0603  [CAP0603]
C50P  1U  CAP0603  [CAP0603]
D40  MBR0530  DIODE_MBR0530  [DIODE_SOD123]
D50  MBR0530  DIODE_MBR0530  [DIODE_SOD123]
H11  HOLE_PTH_1.0MM  [HOLE_PTH_1.0MM]
H12  HOLE_PTH_1.0MM  [HOLE_PTH_1.0MM]
H13  HOLE_PTH_1.0MM  [HOLE_PTH_1.0MM]
H14  HOLE_PTH_1.0MM  [HOLE_PTH_1.0MM]
H15  HOLE_PTH_1.0MM  [HOLE_PTH_1.0MM]
H16  HOLE_PTH_1.0MM  [HOLE_PTH_1.0MM]
L40  SDR0604-101KL  L_SDR0604  [L_SDR0604]
L50  SDR0604-101KL  L_SDR0604  [L_SDR0604]
LD5AFR  L1SP-DRD00035R0000  LED_SMD_SUNPLUS35_REVERSED  [LED_SMD_SUNPLUS35_REVERSED]
LD5AFR1  L1SP-DRD00035R0000  LED_SMD_SUNPLUS35_REVERSED  [LED_SMD_SUNPLUS35_REVERSED]
LD30B1  L1SP-RYL0003500000  LED_SMD_SUNPLUS35  [LED_SMD_SUNPLUS35]
LD30B3  L1SP-RYL0003500000  LED_SMD_SUNPLUS35  [LED_SMD_SUNPLUS35]
LD30B4  L1SP-RYL0003500000  LED_SMD_SUNPLUS35  [LED_SMD_SUNPLUS35]
LD31B1  L1SP-RYL0003500000  LED_SMD_SUNPLUS35  [LED_SMD_SUNPLUS35]
LD31B3  L1SP-RYL0003500000  LED_SMD_SUNPLUS35  [LED_SMD_SUNPLUS35]
LD31B4  L1SP-RYL0003500000  LED_SMD_SUNPLUS35  [LED_SMD_SUNPLUS35]
LD32B1  L1SP-RYL0003500000  LED_SMD_SUNPLUS35  [LED_SMD_SUNPLUS35]
LD32B3  L1SP-RYL0003500000  LED_SMD_SUNPLUS35  [LED_SMD_SUNPLUS35]
LD32B4  L1SP-RYL0003500000  LED_SMD_SUNPLUS35  [LED_SMD_SUNPLUS35]
LD33B1  L1SP-RYL0003500000  LED_SMD_SUNPLUS35  [LED_SMD_SUNPLUS35]
LD33B3  L1SP-RYL0003500000  LED_SMD_SUNPLUS35  [LED_SMD_SUNPLUS35]
LD33B4  L1SP-RYL0003500000  LED_SMD_SUNPLUS35  [LED_SMD_SUNPLUS35]
LD34B1  L1SP-RYL0003500000  LED_SMD_SUNPLUS35  [LED_SMD_SUNPLUS35]
LD34B3  L1SP-RYL0003500000  LED_SMD_SUNPLUS35  [LED_SMD_SUNPLUS35]
LD34B4  L1SP-RYL0003500000  LED_SMD_SUNPLUS35  [LED_SMD_SUNPLUS35]
LD35B1  L1SP-RYL0003500000  LED_SMD_SUNPLUS35  [LED_SMD_SUNPLUS35]
LD35B3  L1SP-RYL0003500000  LED_SMD_SUNPLUS35  [LED_SMD_SUNPLUS35]
LD35B4  L1SP-RYL0003500000  LED_SMD_SUNPLUS35  [LED_SMD_SUNPLUS35]
LD36B1  L1SP-RYL0003500000  LED_SMD_SUNPLUS35  [LED_SMD_SUNPLUS35]
LD36B3  L1SP-RYL0003500000  LED_SMD_SUNPLUS35  [LED_SMD_SUNPLUS35]
LD36B4  L1SP-RYL0003500000  LED_SMD_SUNPLUS35  [LED_SMD_SUNPLUS35]
LD40B  L1SP-RYL0003500000  LED_SMD_SUNPLUS35  [LED_SMD_SUNPLUS35]
LD41B  L1SP-RYL0003500000  LED_SMD_SUNPLUS35  [LED_SMD_SUNPLUS35]
LD42B  L1SP-RYL0003500000  LED_SMD_SUNPLUS35  [LED_SMD_SUNPLUS35]
LD43B  L1SP-RYL0003500000  LED_SMD_SUNPLUS35  [LED_SMD_SUNPLUS35]
LD44B  L1SP-RYL0003500000  LED_SMD_SUNPLUS35  [LED_SMD_SUNPLUS35]
LD45B  L1SP-RYL0003500000  LED_SMD_SUNPLUS35  [LED_SMD_SUNPLUS35]
LD46B  L1SP-RYL0003500000  LED_SMD_SUNPLUS35  [LED_SMD_SUNPLUS35]
LD50FR  L1SP-DRD00035R0000  LED_SMD_SUNPLUS35_REVERSED  [LED_SMD_SUNPLUS35_REVERSED]
LD50FR1  L1SP-DRD00035R0000  LED_SMD_SUNPLUS35_REVERSED  [LED_SMD_SUNPLUS35_REVERSED]
LD51FR  L1SP-DRD00035R0000  LED_SMD_SUNPLUS35_REVERSED  [LED_SMD_SUNPLUS35_REVERSED]
LD51FR1  L1SP-DRD00035R0000  LED_SMD_SUNPLUS35_REVERSED  [LED_SMD_SUNPLUS35_REVERSED]
LD52FR  L1SP-DRD00035R0000  LED_SMD_SUNPLUS35_REVERSED  [LED_SMD_SUNPLUS35_REVERSED]
LD52FR1  L1SP-DRD00035R0000  LED_SMD_SUNPLUS35_REVERSED  [LED_SMD_SUNPLUS35_REVERSED]
LD53FR  L1SP-DRD00035R0000  LED_SMD_SUNPLUS35_REVERSED  [LED_SMD_SUNPLUS35_REVERSED]
LD53FR1  L1SP-DRD00035R0000  LED_SMD_SUNPLUS35_REVERSED  [LED_SMD_SUNPLUS35_REVERSED]
LD54FR  L1SP-DRD00035R0000  LED_SMD_SUNPLUS35_REVERSED  [LED_SMD_SUNPLUS35_REVERSED]
LD54FR1  L1SP-DRD00035R0000  LED_SMD_SUNPLUS35_REVERSED  [LED_SMD_SUNPLUS35_REVERSED]
LD55FR  L1SP-DRD00035R0000  LED_SMD_SUNPLUS35_REVERSED  [LED_SMD_SUNPLUS35_REVERSED]
LD55FR1  L1SP-DRD00035R0000  LED_SMD_SUNPLUS35_REVERSED  [LED_SMD_SUNPLUS35_REVERSED]
LD56FR  L1SP-DRD00035R0000  LED_SMD_SUNPLUS35_REVERSED  [LED_SMD_SUNPLUS35_REVERSED]
LD56FR1  L1SP-DRD00035R0000  LED_SMD_SUNPLUS35_REVERSED  [LED_SMD_SUNPLUS35_REVERSED]
LD57FR  L1SP-DRD00035R0000  LED_SMD_SUNPLUS35_REVERSED  [LED_SMD_SUNPLUS35_REVERSED]
LD57FR1  L1SP-DRD00035R0000  LED_SMD_SUNPLUS35_REVERSED  [LED_SMD_SUNPLUS35_REVERSED]
LD58FR  L1SP-DRD00035R0000  LED_SMD_SUNPLUS35_REVERSED  [LED_SMD_SUNPLUS35_REVERSED]
LD58FR1  L1SP-DRD00035R0000  LED_SMD_SUNPLUS35_REVERSED  [LED_SMD_SUNPLUS35_REVERSED]
LD59FR  L1SP-DRD00035R0000  LED_SMD_SUNPLUS35_REVERSED  [LED_SMD_SUNPLUS35_REVERSED]
LD59FR1  L1SP-DRD00035R0000  LED_SMD_SUNPLUS35_REVERSED  [LED_SMD_SUNPLUS35_REVERSED]
R40  0R5  RES0603  [RES0603]
R40P  10K  RES0603  [RES0603]
R50  0R5  RES0603  [RES0603]
R50P  10K  RES0603  [RES0603]
U40  AL8860  [SOT23-5]
U50  AL8860  [SOT23-5]

### Nets
FRED_PWM0: R50P.1 ; also sheet 2
GND: C40D.2 C40P.2 C50D.2 C50P.2 U40.2(2.GND) U50.2(2.GND) ; also sheet 1,2,3
N$1: LD30B1.C(-) LD31B1.A(+)
N$2: LD31B1.C(-) LD32B1.A(+)
N$4: LD32B1.C(-) LD33B1.A(+)
N$5: LD33B1.C(-) LD34B1.A(+)
N$6: LD34B1.C(-) LD35B1.A(+)
N$7: LD35B1.C(-) LD36B1.A(+)
N$8: LD30B4.C(-) LD31B4.A(+)
N$9: LD31B4.C(-) LD32B4.A(+)
N$10: LD32B4.C(-) LD33B4.A(+)
N$11: LD33B4.C(-) LD34B4.A(+)
N$13: LD34B4.C(-) LD35B4.A(+)
N$14: LD35B4.C(-) LD36B4.A(+)
N$106: LD40B.C(-) LD41B.A(+)
N$107: LD41B.C(-) LD42B.A(+)
N$108: LD42B.C(-) LD43B.A(+)
N$109: LD43B.C(-) LD44B.A(+)
N$110: LD44B.C(-) LD45B.A(+)
N$111: LD45B.C(-) LD46B.A(+)
N$112: LD30B3.C(-) LD31B3.A(+)
N$113: LD31B3.C(-) LD32B3.A(+)
N$114: LD32B3.C(-) LD33B3.A(+)
N$115: LD33B3.C(-) LD34B3.A(+)
N$116: LD34B3.C(-) LD35B3.A(+)
N$117: LD35B3.C(-) LD36B3.A(+)
N$118: LD50FR.A(-) LD51FR.C(+)
N$119: LD51FR.A(-) LD52FR.C(+)
N$120: LD52FR.A(-) LD53FR.C(+)
N$121: LD53FR.A(-) LD54FR.C(+)
N$122: LD54FR.A(-) LD55FR.C(+)
N$123: LD55FR.A(-) LD56FR.C(+)
N$124: LD56FR.A(-) LD57FR.C(+)
N$125: LD57FR.A(-) LD58FR.C(+)
N$126: LD58FR.A(-) LD59FR.C(+)
N$127: LD5AFR.C(+) LD59FR.A(-)
N$128: LD50FR1.A(-) LD51FR1.C(+)
N$129: LD51FR1.A(-) LD52FR1.C(+)
N$130: LD52FR1.A(-) LD53FR1.C(+)
N$131: LD53FR1.A(-) LD54FR1.C(+)
N$132: LD54FR1.A(-) LD55FR1.C(+)
N$133: LD55FR1.A(-) LD56FR1.C(+)
N$134: LD56FR1.A(-) LD57FR1.C(+)
N$135: LD57FR1.A(-) LD58FR1.C(+)
N$136: LD58FR1.A(-) LD59FR1.C(+)
N$137: LD5AFR1.C(+) LD59FR1.A(-)
N$145: H11.1 H15.1 L40.1 LD36B1.C(-) LD36B3.C(-) LD36B4.C(-) LD46B.C(-)
N$146: H12.1 LD30B1.A(+) LD30B3.A(+) LD30B4.A(+) LD40B.A(+) R40.2 U40.4(4.ISENSE)
N$150: H14.1 H16.1 LD50FR1.C(+) LD50FR.C(+) R50.2 U50.4(4.ISENSE)
N$157: D50.2(+) L50.2 U50.1(1.LX)
N$158: C50P.1 R50P.2 U50.3(3.VSET)
N$159: H13.1 L50.1 LD5AFR1.A(-) LD5AFR.A(-)
N$160: D40.2(+) L40.2 U40.1(1.LX)
N$161: C40P.1 R40P.2 U40.3(3.VSET)
RBLU_PWM0: R40P.1 ; also sheet 2
VDD_24V: C40D.1 C50D.1 D40.1-(-) D50.1-(-) R40.1 R50.1 U40.5(5.VIN) U50.5(5.VIN) ; supply symbol labelled VCC_24V ; also sheet 1,2,3

### Notes on the sheet
- Vf_blue = 2V5..3V5 -> 9..6 LEDs in series, take 7
- ROYAL BLUE: 440..455nm
- Vf_far-red  = 1V4..2V2 -> 17..10 LEDs in series, take 11
- FAR RED: 720..740nm
- * PINNING | : OK
- * FUNCTIONALITY | : OK
- * PHYSICAL SIZE | : OK
- Light Plate - Royal Blue & Far Red LEDs
- * IN HOUSE | : OK
- * LAID OUT | : OK | 180528 | 1.0
- * COMPS IN LIB | : OK

## Library data of the parts
C01 C02 C10D C10R C11D C12D C30D C30P C31D C31P C32D C32P C40D C40P C50D C50P = 00-own_parts:CAP0603: Capacitor, ceramic, 0603
D01 = 00-own_parts:DIODE_15MQ040: Diode, Schottky, 15MQ040, 40V/3A, SMA, F# 165-1114
D30-D32 D40 D50 = 00-own_parts:DIODE_MBR0530: Doide, Schottky, MBR0503, 30V/0A5, SOD-123, F#: 143-1036
H1-H4 = 00-own_parts:HOLE_3.2MM: Hole, PTH, 3.2mm
H5-H16 = 00-own_parts:HOLE_PTH_1.0MM: Hole, PTH, 1.0mm
J10B J11B = 00-own_parts:CON_USB-C_RECEPTABLE_THT-SMD: Connector, DB25, male, straight, wirewarp, press nuts, DK#: 2625FA-ND
J10P = 00-own_parts:CON_DF58-3P-1.2V_SMD: Connector, DF58, 3 way, 1,2mm pitch, SMD
J10S = 00-own_parts:CON_MOLEX_3H_RS232_SMD: Connector, RS232, 3p, SMD pads
L10 = 00-own_parts:L_0603: Inductor, 0603, chip ferrite bead
L30-L32 L40 L50 = 00-own_parts:L_SDR0604: Inductor, Bourns SDR0604
LD01-G LD02-G LD10-R LD11-G LD12R LD13G = 00-own_parts:LED_SMD_0603: LED, SMD, 0603
LD5AFR LD5AFR1 LD30DR LD30DR1-LD30DR98 LD50FR LD50FR1 LD51FR LD51FR1 LD52FR LD52FR1 LD53FR LD53FR1 LD54FR LD54FR1 LD55FR LD55FR1 LD56FR LD56FR1 LD57FR LD57FR1 LD58FR LD58FR1 LD59FR LD59FR1 = 00-own_parts:LED_SMD_SUNPLUS35_REVERSED: LED, SMD, SunPlus35 Horticulture, 3.5x3.4mm, reversed polarity
LD30B1 LD30B3 LD30B4 LD31B1 LD31B3 LD31B4 LD32B1 LD32B3 LD32B4 LD33B1 LD33B3 LD33B4 LD34B1 LD34B3 LD34B4 LD35B1 LD35B3 LD35B4 LD36B1 LD36B3 LD36B4 LD40B LD41B LD42B LD43B LD44B LD45B LD46B = 00-own_parts:LED_SMD_SUNPLUS35: LED, SMD, SunPlus35 Horticulture, 3.5x3.4mm
R01L R02L R10L R10N R10T R11L R11N R12L R13L R30 R30P R31 R31P R32 R32P R40 R40P R50 R50P = 00-own_parts:RES
RESET = 00-own_parts:SWITCH_PUSHBUTTON: Switch, push button, SPNO, MCTAEF, F# 160-5485
U01 = 00-own_parts:MCP1804T-3302I/OT: Regulator, LDO w. enable, Vin=2.0..28V, Vout=3V3, Vdrop = 260mV, SOT23-5,
U10 = 00-own_parts:STM32F042F6P6: MCU, low power, ARM Cortex M0, 32-bit, 48 MHz, 32 kB Flash, 6 kB SRAM, 8 kB EEPROM, RTC, xtal-less USB, ADC, cap. touch sensing, TSSOP20
U11 = 00-own_parts:MAX3362: Transceiver, RS485/422, 3V3, SOT23-8
U30-U32 U40 U50 = 00-own_parts:AL8860: DC/DC converter, step-down, LED driver, 40V/1A, TSOT25
Z01 Z02 Z10U Z11U = 00-own_parts:ZENER_SOD80: Zener, generic SOD80

## Board
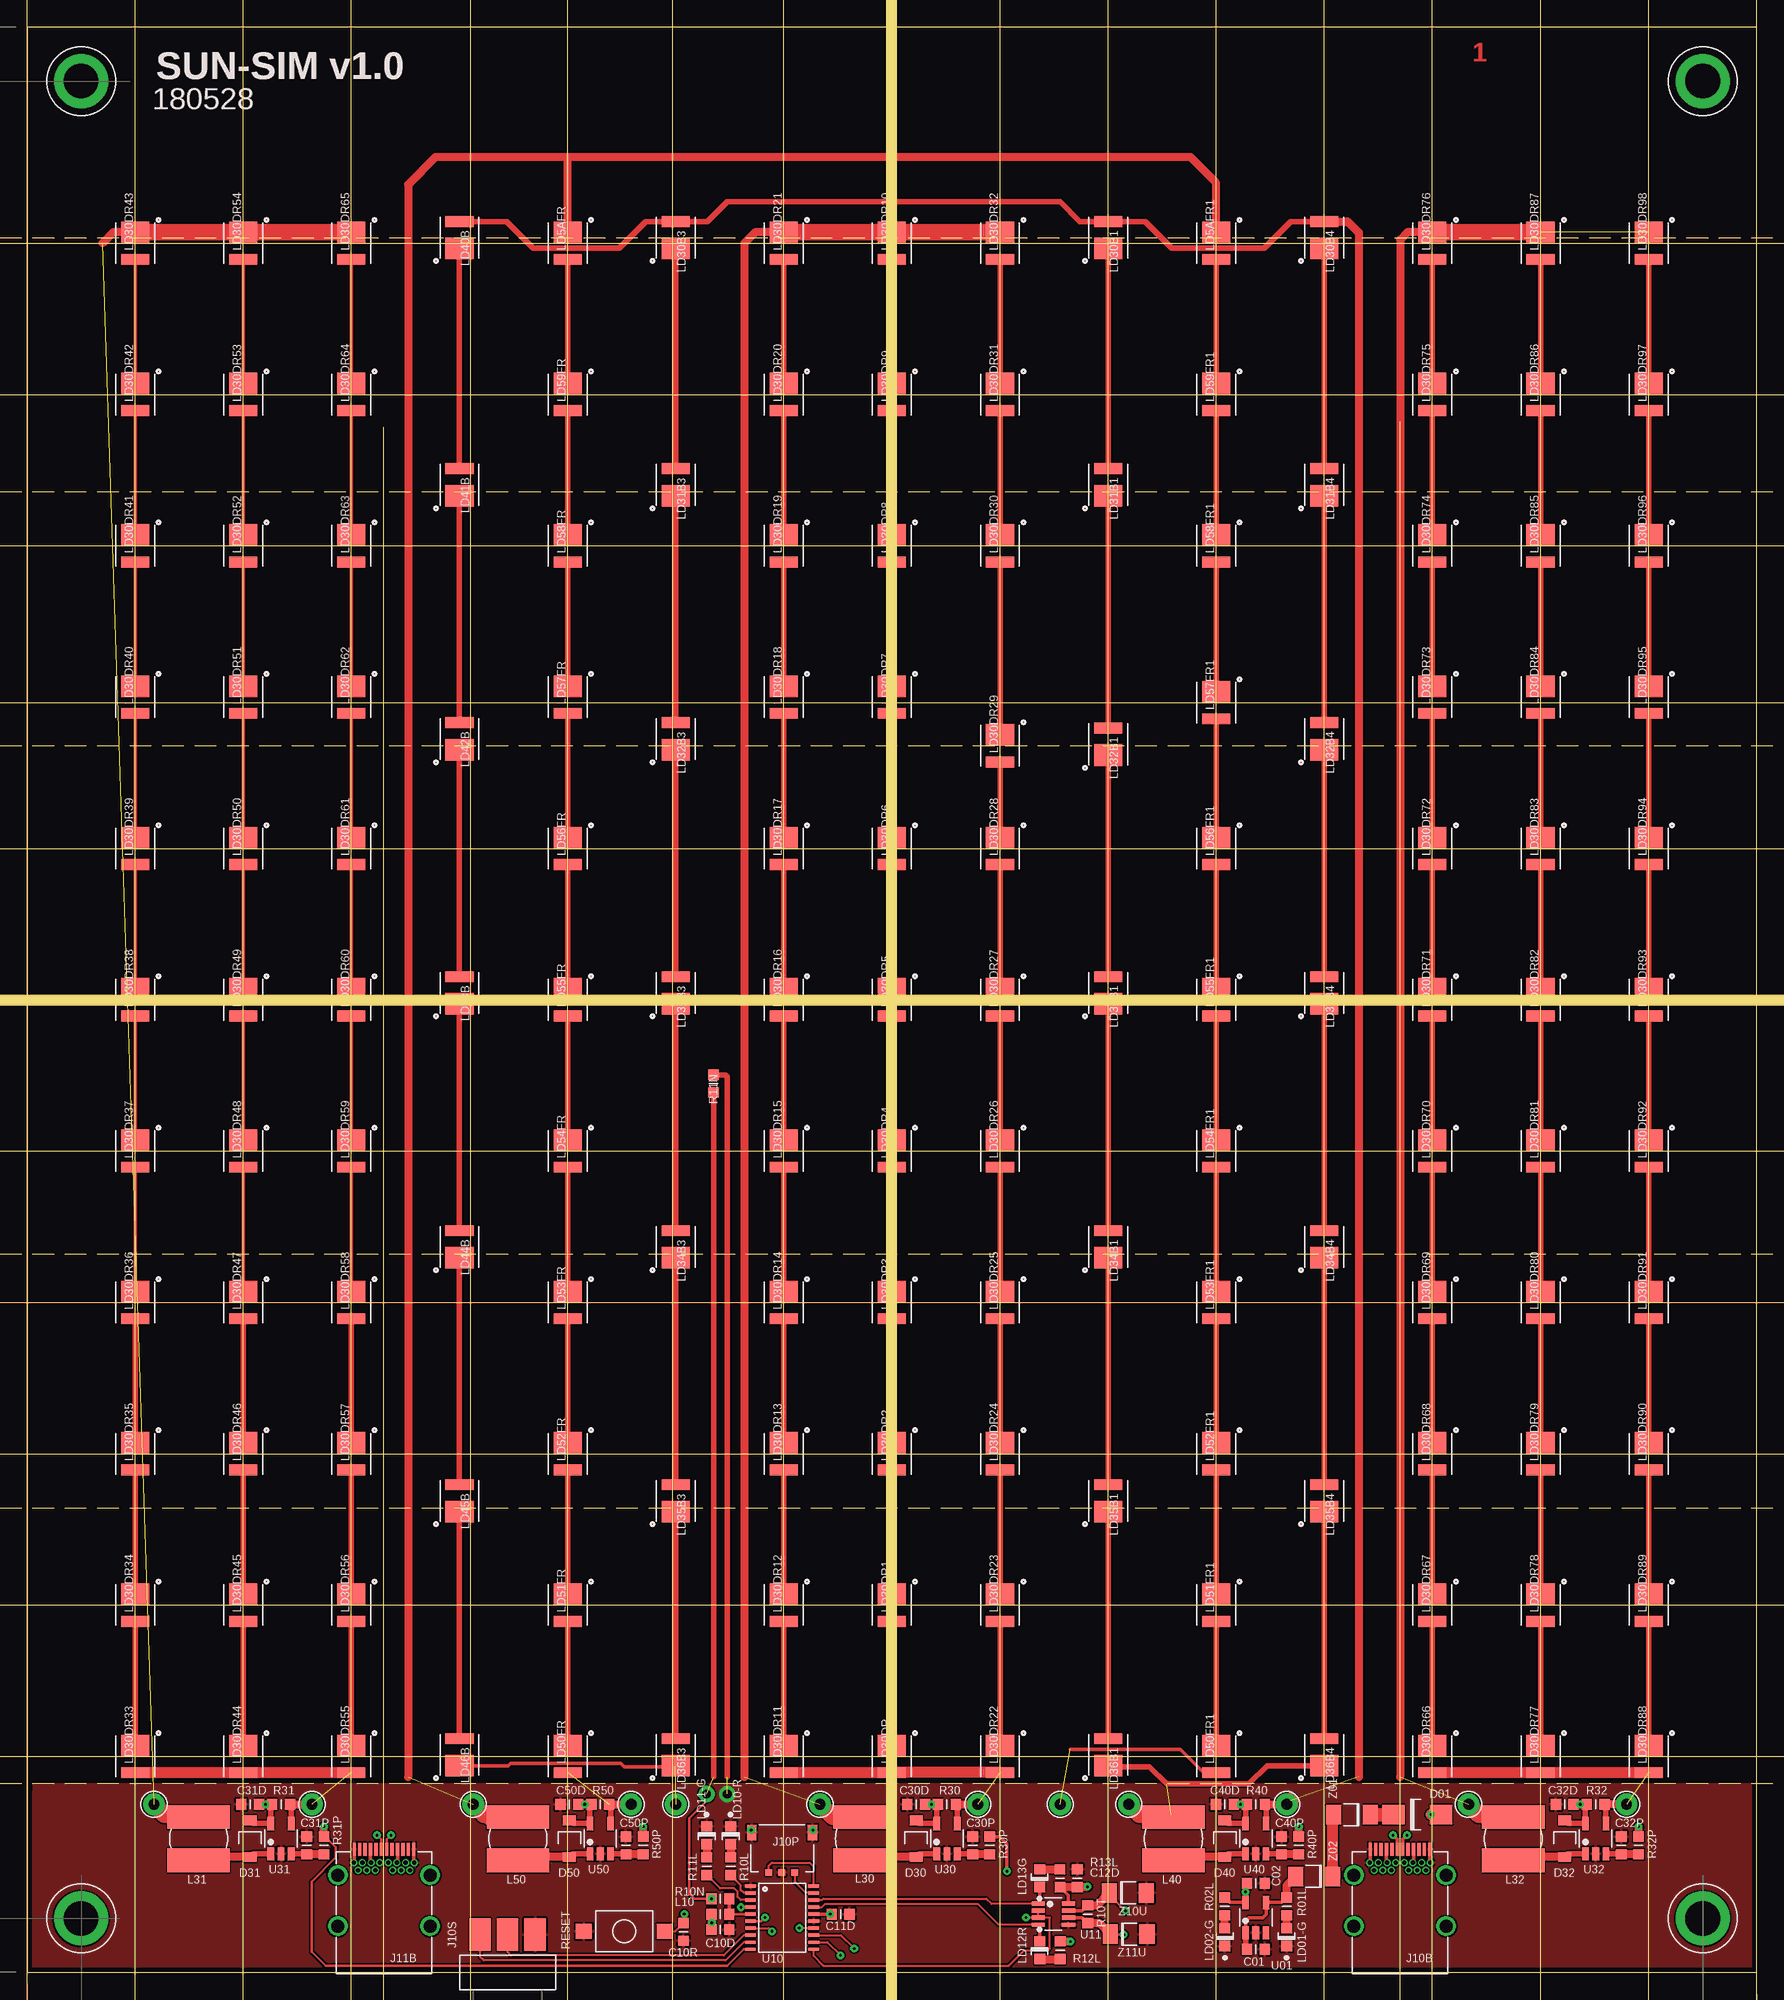
[diagram p4: board, top side]
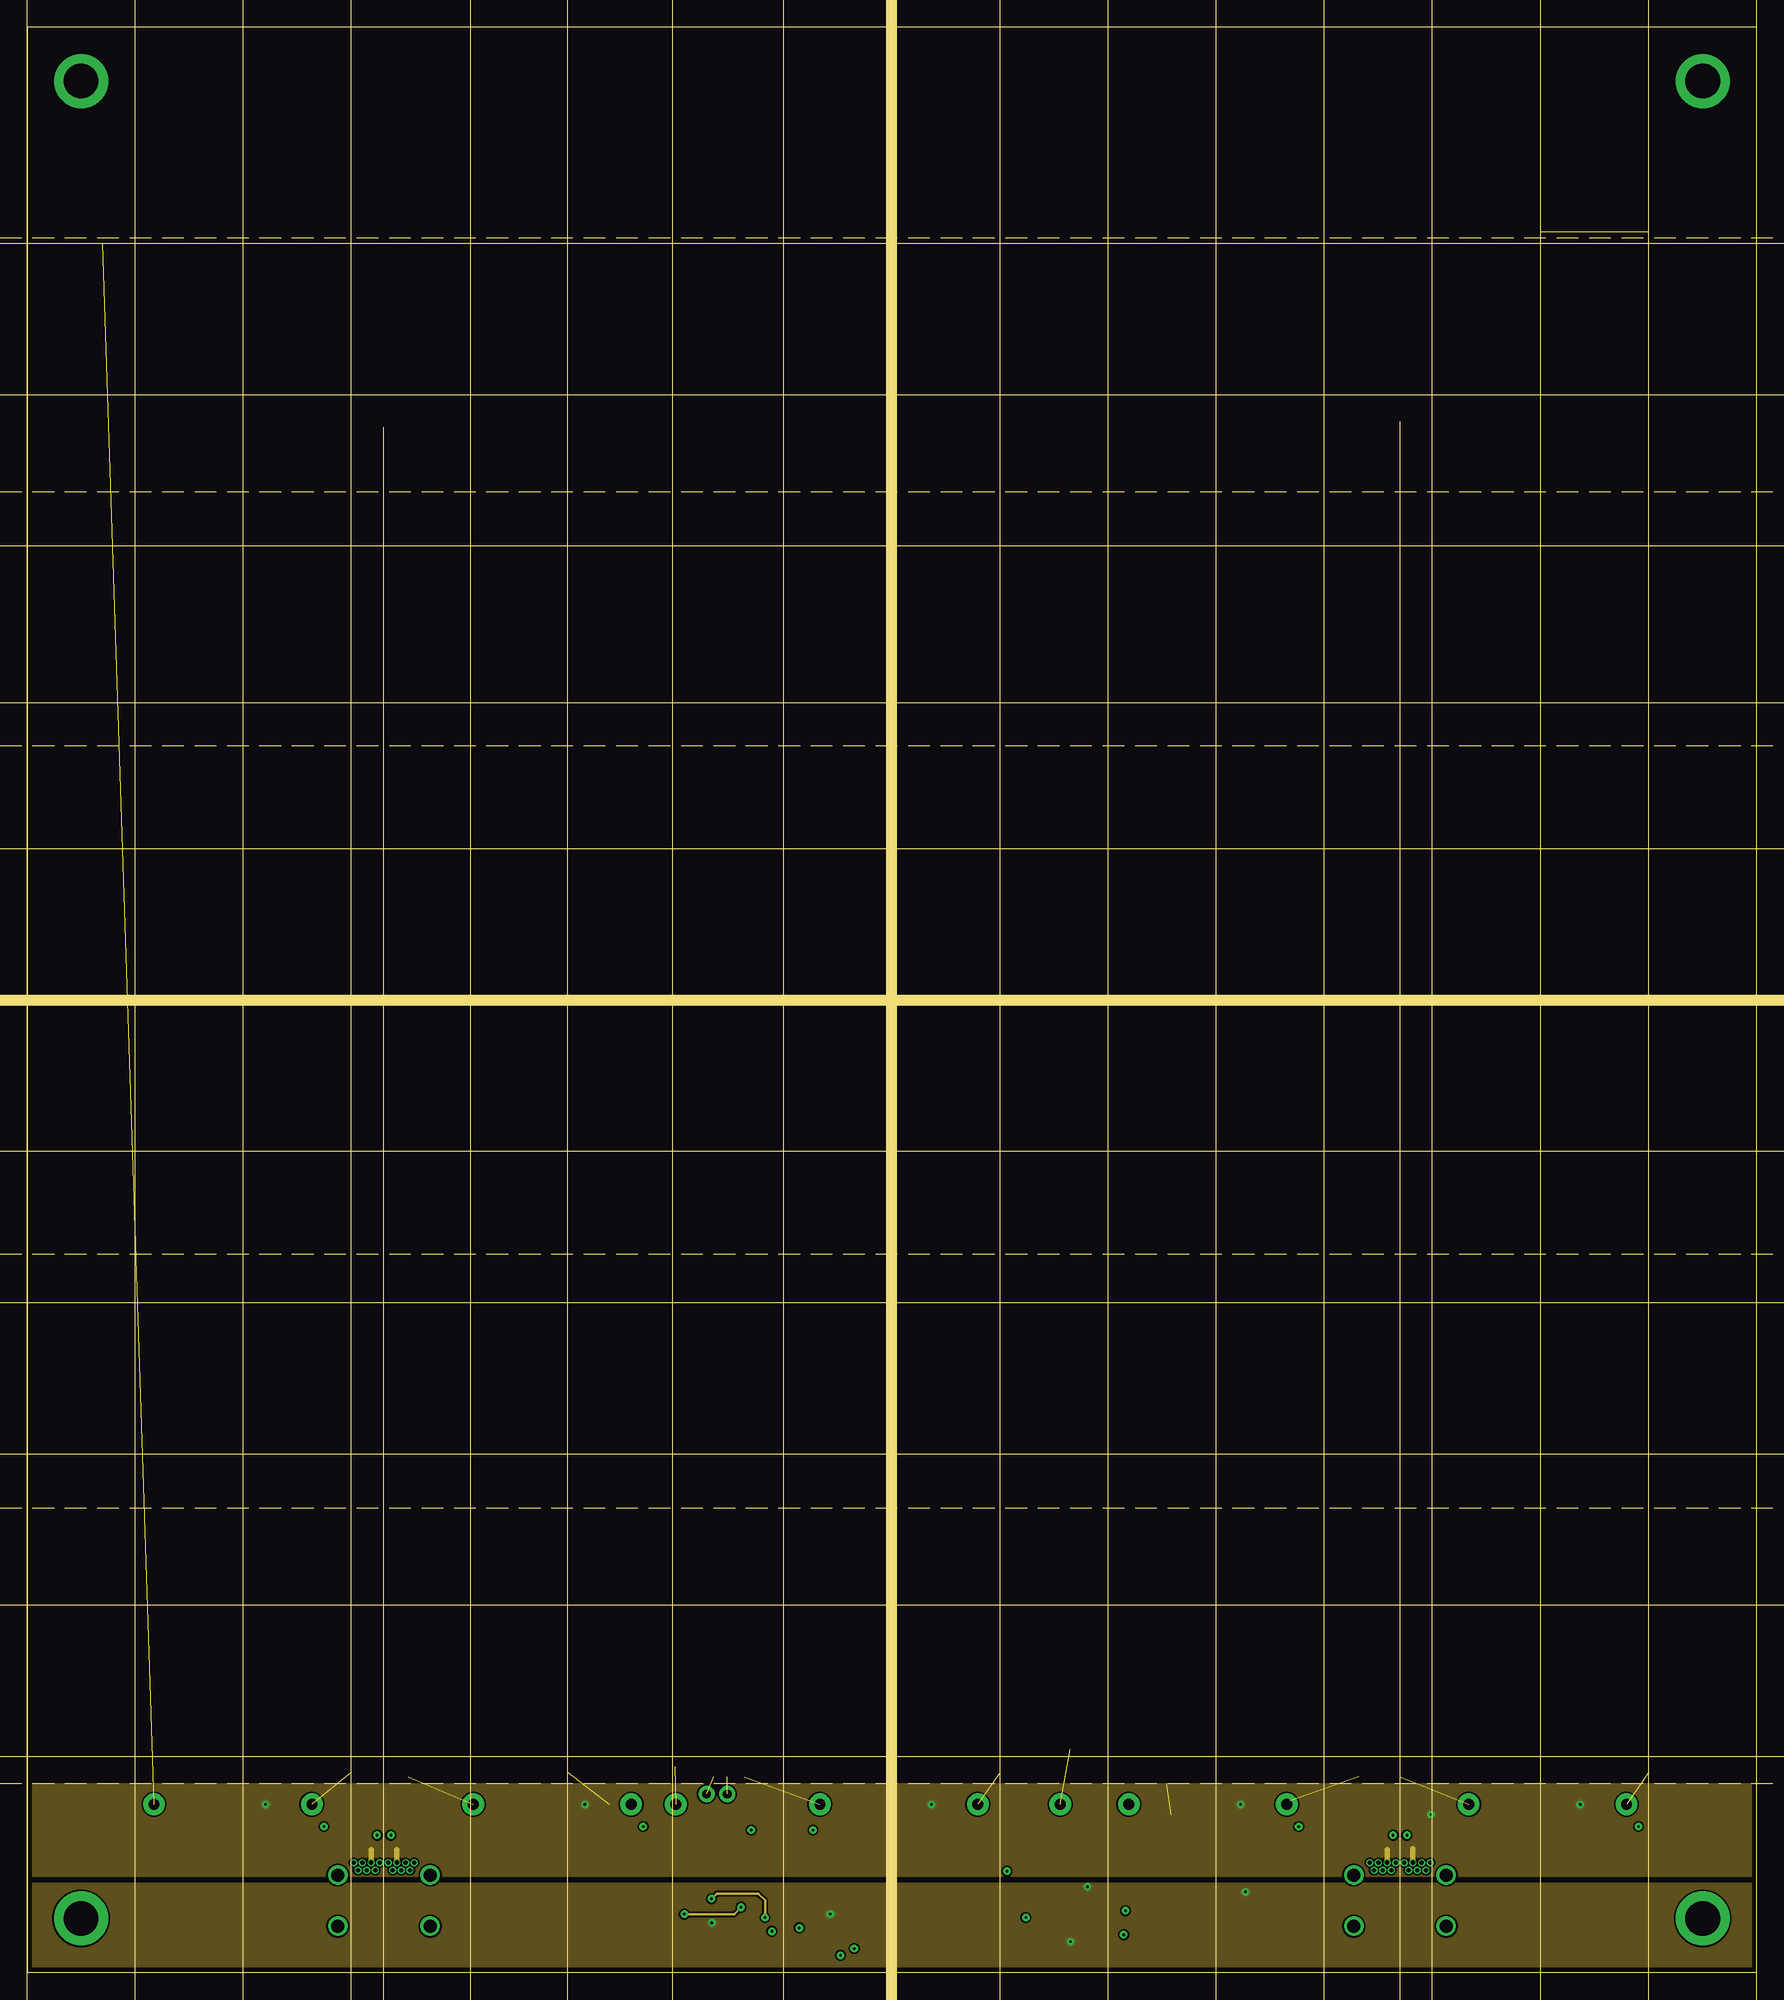
[diagram p5: board, inner layer Route2]
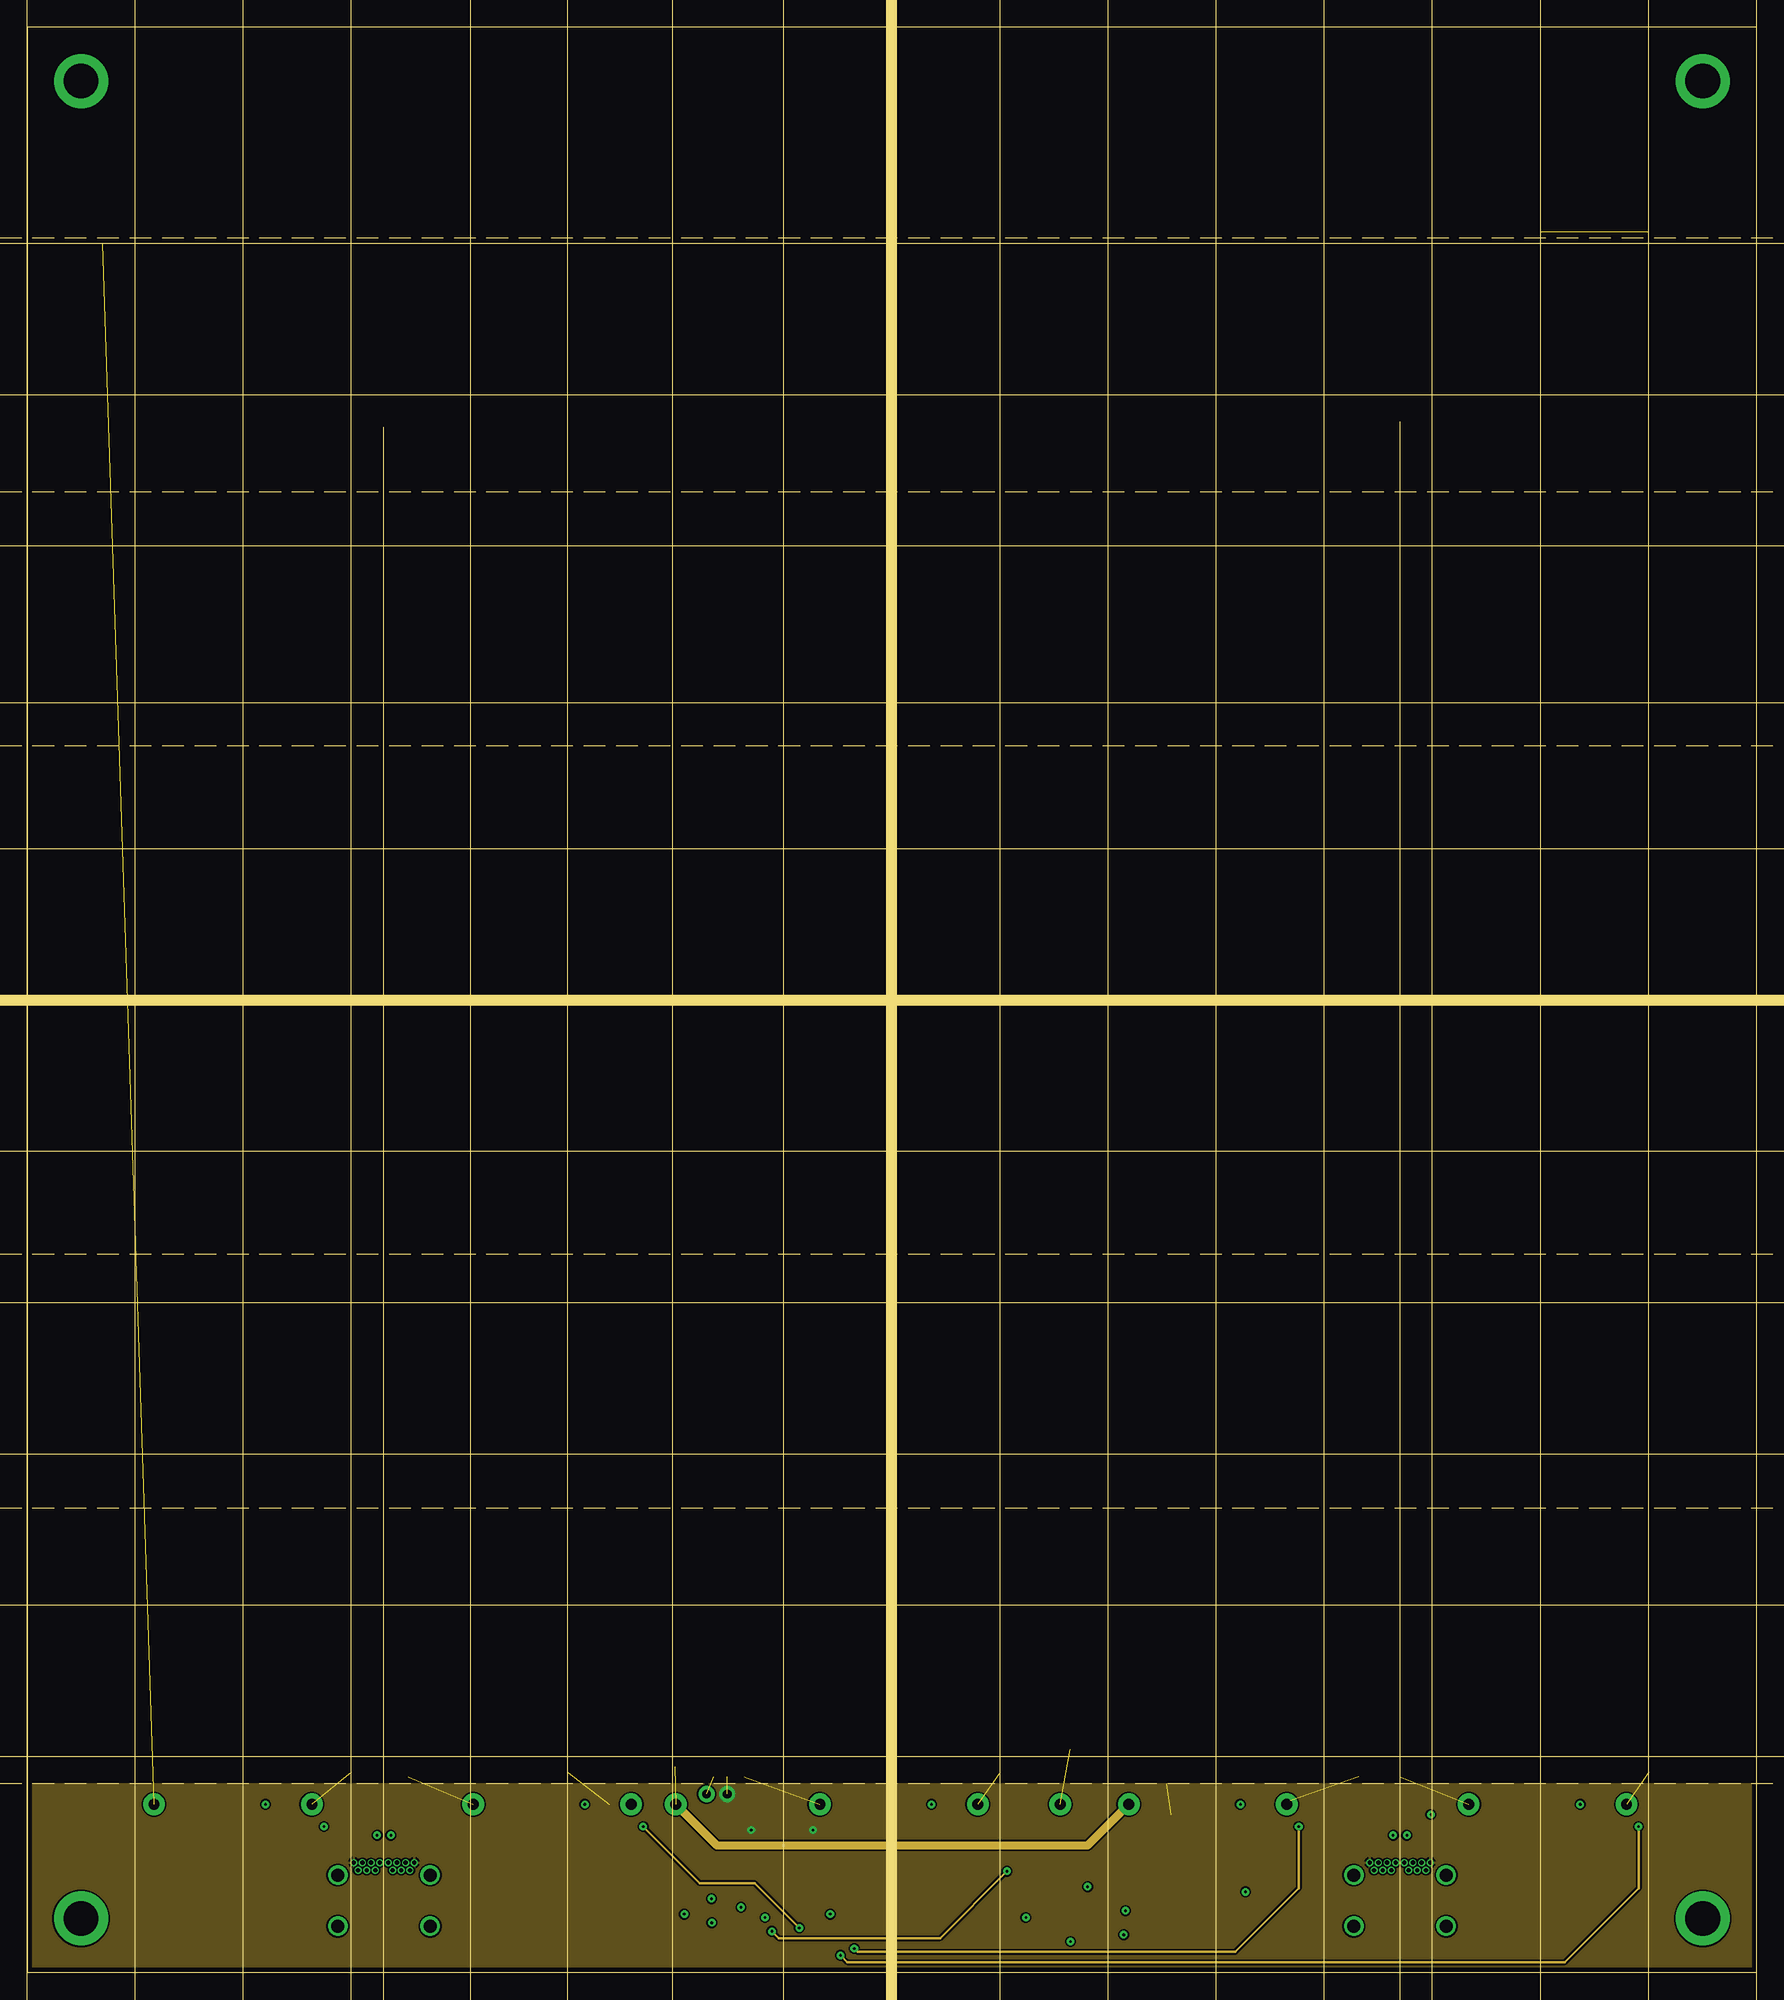
[diagram p6: board, inner layer Route15]
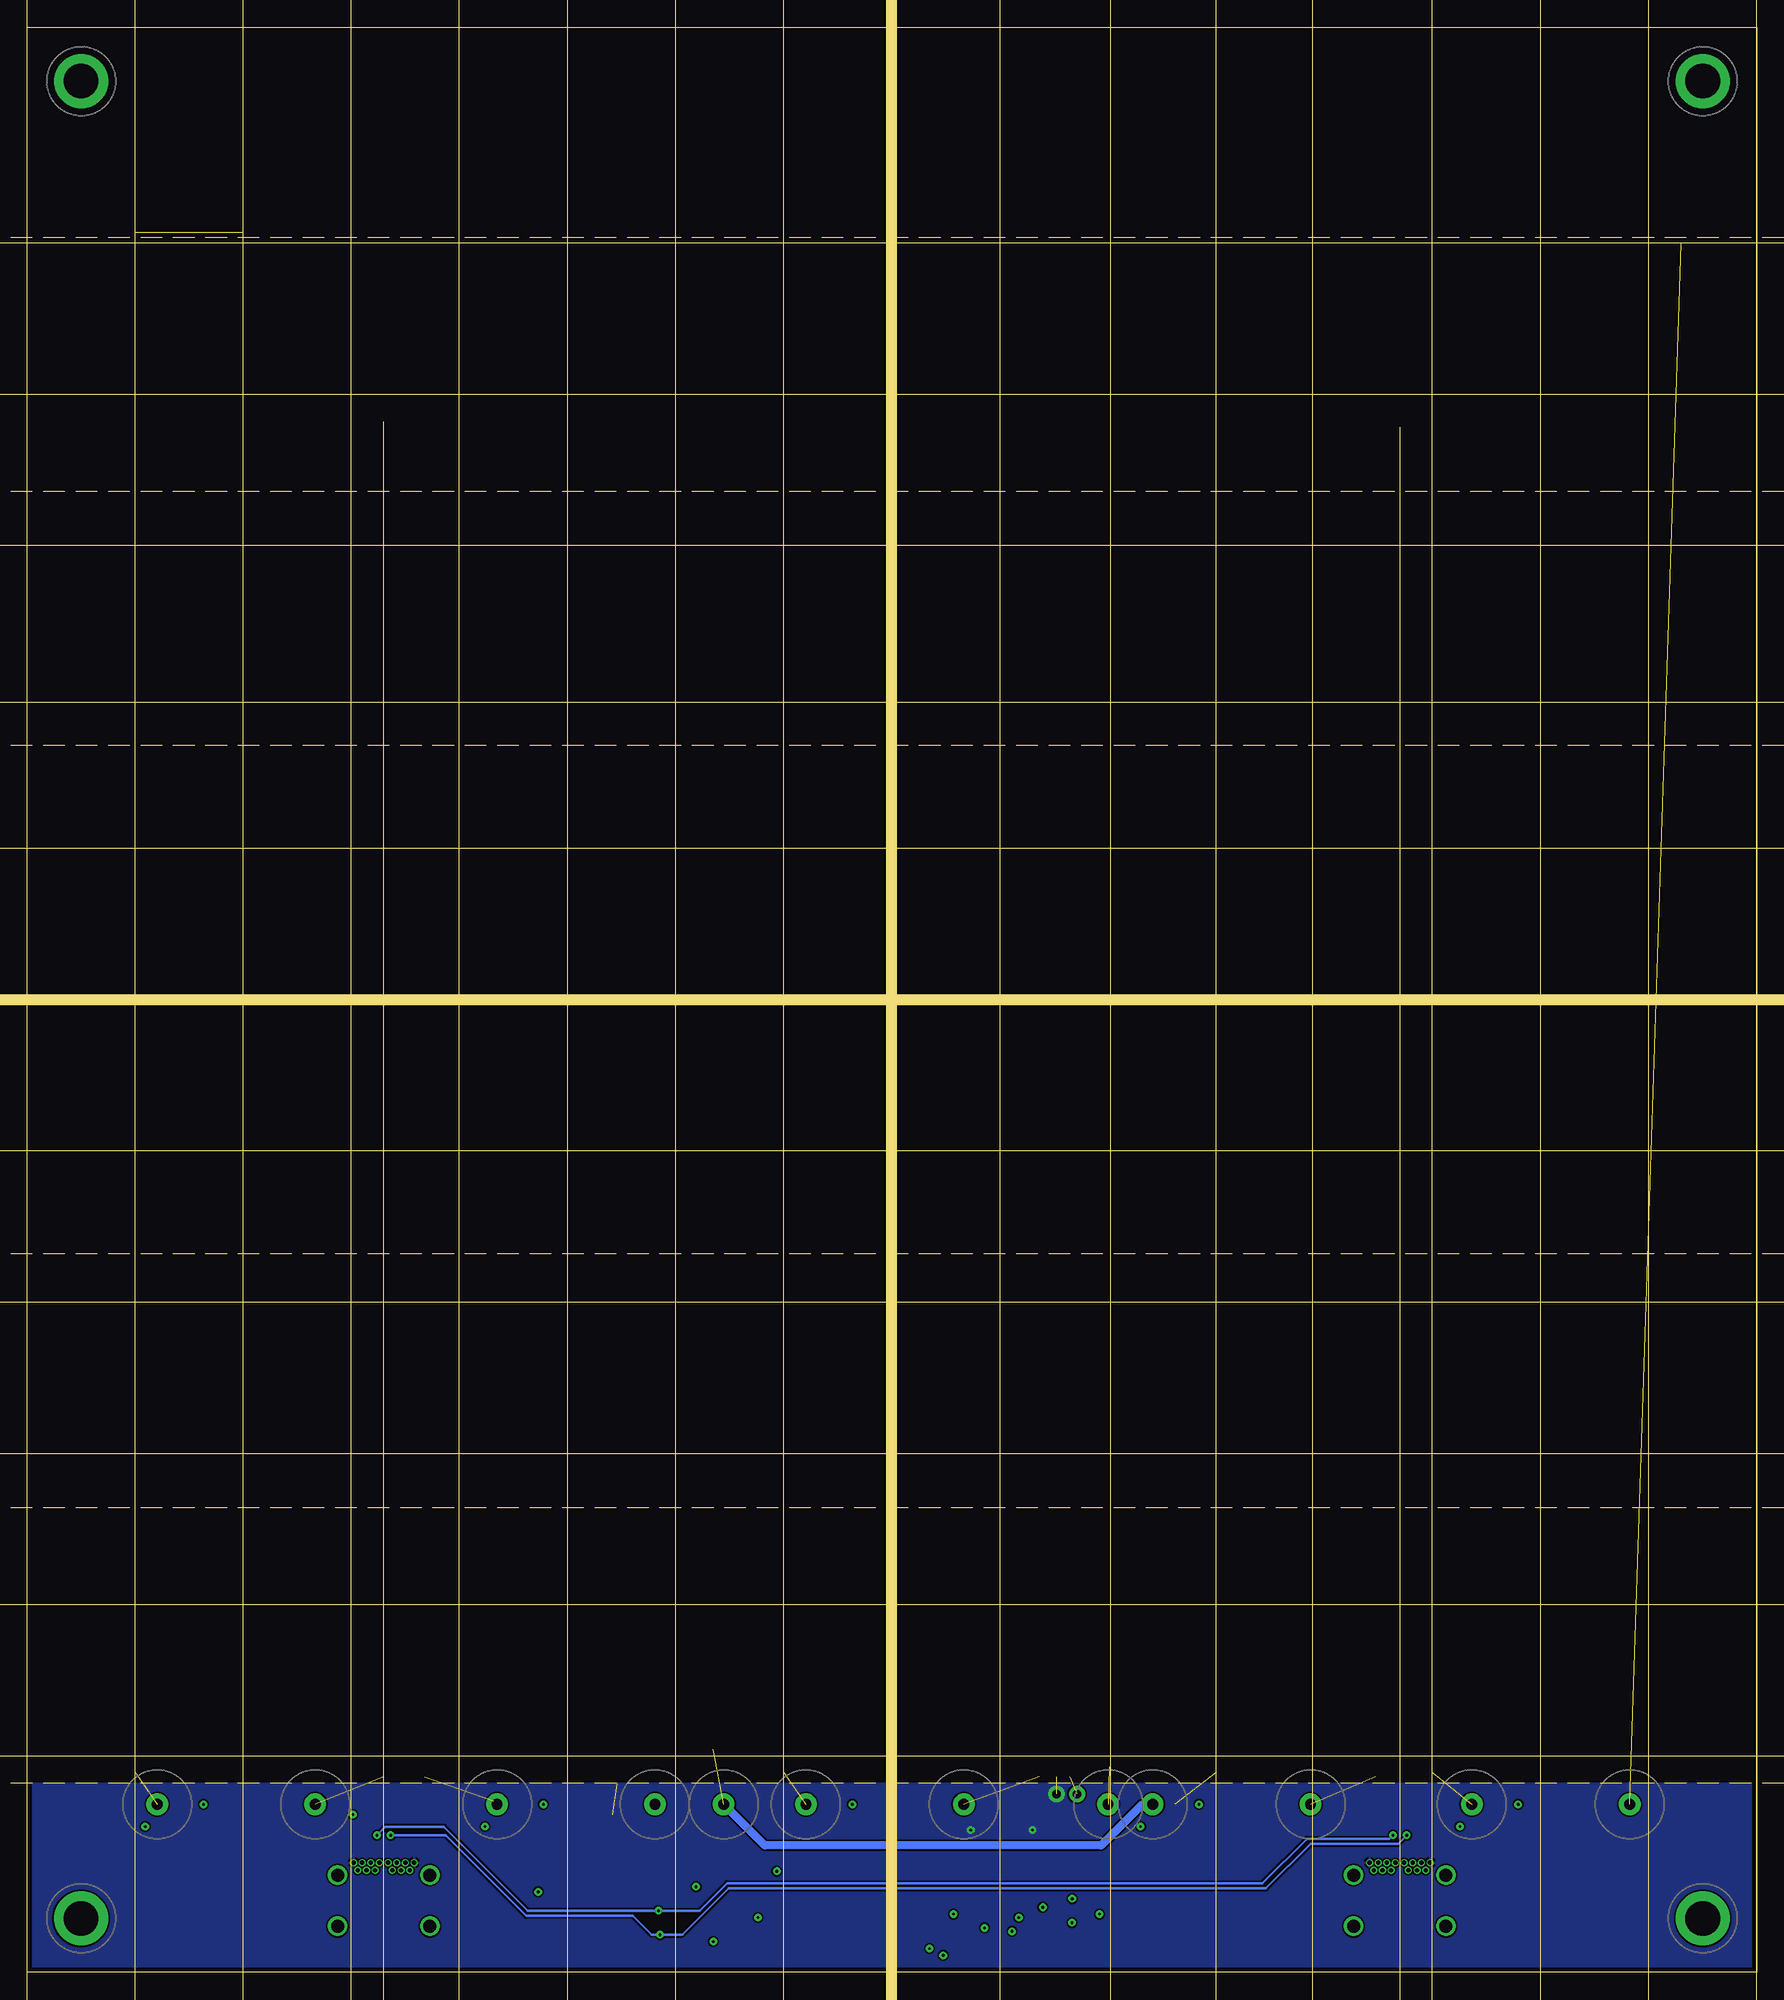
[diagram p7: board, bottom side, seen from below]

Size 160 x 180 mm. Coordinates in mm from the lower left corner, seen from the top.
Outline: 0,0 160,0 160,180 0,180 0,0
Copper layers (1*2*15*16): Top 0.018mm / dielectric 0.36mm / Route2 0.035mm / dielectric 0.71mm / Route15 0.035mm / dielectric 0.2mm / Bottom 0.018mm
Design rules: minimum track width 0.15mm, minimum drill 0.25mm, track to track 0.15mm, track to pad 0.15mm, pad to pad 0.15mm, via to via 0.15mm, smd to smd 0mil, copper to edge 0.45mm, drill to drill 0.3mm, minimum pad ring 0.125mm, minimum via ring 0.2mm, stop-mask expansion 0.1mm, vias tented up to drill 0mil, thermal gap 0.2mm
Milling: 366 lines

### Footprints (pad centres in the part's own frame; a part is rotated, then mirrored left to right if it is on the bottom)
CAP0603 = smd 0.95 x 1: 1 -0.821,0.002; 2 0.822,0
DIODE_SMA = smd 2.1 x 1.8: A -2.2,0; C 2.2,0
DIODE_SOD123 = smd 0.9 x 1.2: 1- -1.7,0; 2 1.7,0
HOLE_PTH_3.2MM = drill 3.2 pad 5: 1 0,0
HOLE_PTH_1.0MM = drill 1 pad 2: 1 0,0
CON_USB-C_RECEPTABLE_THT-SMD = smd 0.3 x 1.2: A1 -2.75,1.25; A2 -2.25,1.25; A3 -1.75,1.25; A4 -1.25,1.25; A5 -0.75,1.25; A6 -0.25,1.25; A7 0.25,1.25; A8 0.75,1.25; A9 1.25,1.25; A10 1.75,1.25; A11 2.25,1.25; A12 2.75,1.25 | drill 0.4 pad 0.65: B1 2.8,0; B2 2.4,-0.7; B3 1.6,-0.7; B4 1.2,0; B5 0.8,-0.7; B6 0.4,0; B7 -0.4,0; B8 -0.8,-0.7; B9 -1.2,0; B10 -1.6,-0.7; B11 -2.4,-0.7; B12 -2.8,0; BG1 2,0; BG2 -2,0 | drill 1.2 pad 1.8: C1 -4.27,-5.88; C2 4.27,-5.88; C3 -4.27,-1.15; C4 4.27,-1.15
CON_DF58-3P-1.2V_SMD = smd 0.65 x 0.6: 1 -1.15,4.4; 2 0.05,4.4; 3 1.25,4.4 | smd 0.85 x 1.4: GND1 -2.8,0.7; GND2 2.8,0.7
CON_MOLEX_3H+SMD = smd 2 x 3: 1 -2.54,0; 2 0,0; 3 2.54,0
L_0603 = smd 0.95 x 1: 1 -0.821,0.002; 2 0.822,0
L_SDR0604 = smd 2.2 x 5.8: 1 -2,0; 2 2,0
LED_SMD_0603 = smd 0.95 x 1: A -0.827,0; C 0.827,0
LED_SMD_SUNPLUS35_REVERSED = smd 2 x 2.6: A 1,0 | smd 1 x 2.6: C -1.5,0
LED_SMD_SUNPLUS35 = smd 1 x 2.6: A -1.5,0 | smd 2 x 2.6: C 1,0
RES0603 = smd 0.95 x 1: 1 -0.821,0.002; 2 0.822,0
SWITCH_SMD_PBUTTON_2P = smd 1.5 x 1.4: 1 -3.75,0; 2 3.75,0
SOT23-5 = smd 0.62 x 1.22: 1 -0.95,-1.4; 2 0,-1.4; 3 0.95,-1.4; 4 0.95,1.4; 5 -0.95,1.4
TSSOP20 = smd 0.305 x 0.991: 1 -2.925,-2.918; 2 -2.275,-2.918; 3 -1.625,-2.918; 4 -0.975,-2.918; 5 -0.325,-2.918; 6 0.325,-2.918; 7 0.975,-2.918; 8 1.625,-2.918; 9 2.275,-2.918; 10 2.925,-2.918; 11 2.925,2.918; 12 2.275,2.918; 13 1.625,2.918; 14 0.975,2.918; 15 0.325,2.918; 16 -0.325,2.918; 17 -0.975,2.918; 18 -1.625,2.918; 19 -2.275,2.918; 20 -2.925,2.918
SOT23-8 = smd 0.4 x 1.22: 1 -0.975,-1.4; 2 -0.325,-1.4; 3 0.325,-1.4; 4 0.975,-1.4; 5 0.975,1.4; 6 0.325,1.4; 7 -0.325,1.4; 8 -0.975,1.4
ZENER_SOD80 = smd 1.4 x 1.8: 1 -1.7,0; 2 1.7,0

### Placement (x,y rotation side)
C01  113.67,2.15 0 top
C02  113.67,8.26 0 top
C10D  64.14,3.97 0 top
C10R  60.72,3.75 270 top
C11D  75.25,5.4 0 top
C12D  97.16,8.73 90 top
C30D  82.23,15.56 180 top
C30P  87.47,11.75 90 top
C31D  20.64,15.56 180 top
C31P  25.88,11.75 90 top
C32D  142.24,15.56 180 top
C32P  147.48,11.75 90 top
C40D  110.81,15.56 180 top
C40P  116.05,11.75 90 top
C50D  50.16,15.56 180 top
C50P  55.4,11.75 90 top
D01  128.59,14.61 180 top
D30  82.23,12.38 270 top
D31  20.64,12.38 270 top
D32  142.24,12.38 270 top
D40  110.81,12.38 270 top
D50  50.16,12.38 270 top
H1  155,175 0 top
H2  5,5 0 top
H3  155,5 0 top
H4  5,175 0 top
H5  73.34,15.56 0 top
H6  87.95,15.56 0 top
H7  11.75,15.56 0 top
H8  26.35,15.56 0 top
H9  133.35,15.56 90 top
H10  147.96,15.56 90 top
H11  101.92,15.56 0 top
H12  116.52,15.56 0 top
H13  41.27,15.56 0 top
H14  55.88,15.56 0 top
H15  60.01,15.56 0 top
H16  95.57,15.56 0 top
J10B  127,10.16 0 top
J10P  69.85,13.65 180 top
J10S  44.45,3.49 0 top
J11B  33.02,10.16 0 top
L10  64.14,5.4 0 top
L30  77.47,12.38 270 top
L31  15.88,12.38 270 top
L32  137.48,12.38 270 top
L40  106.05,12.38 270 top
L50  45.4,12.38 270 top
LD01-G  116.51,3.27 270 top
LD02-G  110.8,3.27 270 top
LD5AFR  50,160 90 top
LD5AFR1  110,160 90 top
LD10-R  65.09,12.7 90 top
LD11-G  62.87,12.7 90 top
LD12R  93.66,2.06 90 top
LD13G  93.66,8.73 270 top
LD30B1  100,160.5 270 top
LD30B3  60,160.5 270 top
LD30B4  120,160.5 270 top
LD30DR  80,20 90 top
LD30DR1  80,34 90 top
LD30DR2  80,48 90 top
LD30DR3  80,62 90 top
LD30DR4  80,76 90 top
LD30DR5  80,90 90 top
LD30DR6  80,104 90 top
LD30DR7  80,118 90 top
LD30DR8  80,132 90 top
LD30DR9  80,146 90 top
LD30DR10  80,160 90 top
LD30DR11  70,20 90 top
LD30DR12  70,34 90 top
LD30DR13  70,48 90 top
LD30DR14  70,62 90 top
LD30DR15  70,76 90 top
LD30DR16  70,90 90 top
LD30DR17  70,104 90 top
LD30DR18  70,118 90 top
LD30DR19  70,132 90 top
LD30DR20  70,146 90 top
LD30DR21  70,160 90 top
LD30DR22  90,20 90 top
LD30DR23  90,34 90 top
LD30DR24  90,48 90 top
LD30DR25  90,62 90 top
LD30DR26  90,76 90 top
LD30DR27  90,90 90 top
LD30DR28  90,104 90 top
LD30DR29  90,113.5 90 top
LD30DR30  90,132 90 top
LD30DR31  90,146 90 top
LD30DR32  90,160 90 top
LD30DR33  10,20 90 top
LD30DR34  10,34 90 top
LD30DR35  10,48 90 top
LD30DR36  10,62 90 top
LD30DR37  10,76 90 top
LD30DR38  10,90 90 top
LD30DR39  10,104 90 top
LD30DR40  10,118 90 top
LD30DR41  10,132 90 top
LD30DR42  10,146 90 top
LD30DR43  10,160 90 top
LD30DR44  20,20 90 top
LD30DR45  20,34 90 top
LD30DR46  20,48 90 top
LD30DR47  20,62 90 top
LD30DR48  20,76 90 top
LD30DR49  20,90 90 top
LD30DR50  20,104 90 top
LD30DR51  20,118 90 top
LD30DR52  20,132 90 top
LD30DR53  20,146 90 top
LD30DR54  20,160 90 top
LD30DR55  30,20 90 top
LD30DR56  30,34 90 top
LD30DR57  30,48 90 top
LD30DR58  30,62 90 top
LD30DR59  30,76 90 top
LD30DR60  30,90 90 top
LD30DR61  30,104 90 top
LD30DR62  30,118 90 top
LD30DR63  30,132 90 top
LD30DR64  30,146 90 top
LD30DR65  30,160 90 top
LD30DR66  130,20 90 top
LD30DR67  130,34 90 top
LD30DR68  130,48 90 top
LD30DR69  130,62 90 top
LD30DR70  130,76 90 top
LD30DR71  130,90 90 top
LD30DR72  130,104 90 top
LD30DR73  130,118 90 top
LD30DR74  130,132 90 top
LD30DR75  130,146 90 top
LD30DR76  130,160 90 top
LD30DR77  140,20 90 top
LD30DR78  140,34 90 top
LD30DR79  140,48 90 top
LD30DR80  140,62 90 top
LD30DR81  140,76 90 top
LD30DR82  140,90 90 top
LD30DR83  140,104 90 top
LD30DR84  140,118 90 top
LD30DR85  140,132 90 top
LD30DR86  140,146 90 top
LD30DR87  140,160 90 top
LD30DR88  150,20 90 top
LD30DR89  150,34 90 top
LD30DR90  150,48 90 top
LD30DR91  150,62 90 top
LD30DR92  150,76 90 top
LD30DR93  150,90 90 top
LD30DR94  150,104 90 top
LD30DR95  150,118 90 top
LD30DR96  150,132 90 top
LD30DR97  150,146 90 top
LD30DR98  150,160 90 top
LD31B1  100,137.63 270 top
LD31B3  60,137.63 270 top
LD31B4  120,137.63 270 top
LD32B1  100,113.64 270 top
LD32B3  60,114.14 270 top
LD32B4  120,114.14 270 top
LD33B1  100,90.64 270 top
LD33B3  60,90.64 270 top
LD33B4  120,90.64 270 top
LD34B1  100,67.14 270 top
LD34B3  60,67.14 270 top
LD34B4  120,67.14 270 top
LD35B1  100,43.63 270 top
LD35B3  60,43.63 270 top
LD35B4  120,43.63 270 top
LD36B1  100,20.14 270 top
LD36B3  60,20.14 270 top
LD36B4  120,20.14 270 top
LD40B  40,160.5 270 top
LD41B  40,137.63 270 top
LD42B  40,114.14 270 top
LD43B  40,90.64 270 top
LD44B  40,67.14 270 top
LD45B  40,43.63 270 top
LD46B  40,20.14 270 top
LD50FR  50,20 90 top
LD50FR1  110,20 90 top
LD51FR  50,34 90 top
LD51FR1  110,34 90 top
LD52FR  50,48 90 top
LD52FR1  110,48 90 top
LD53FR  50,62 90 top
LD53FR1  110,62 90 top
LD54FR  50,76 90 top
LD54FR1  110,76 90 top
LD55FR  50,90 90 top
LD55FR1  110,90 90 top
LD56FR  50,104 90 top
LD56FR1  110,104 90 top
LD57FR  50,118 90 top
LD57FR1  110,117.5 90 top
LD58FR  50,132 90 top
LD58FR1  110,132 90 top
LD59FR  50,146 90 top
LD59FR1  110,146 90 top
R01L  116.51,6.12 270 top
R02L  110.8,6.12 270 top
R10L  65.09,9.84 90 top
R10N  64.14,6.83 0 top
R10T  98.11,5.4 90 top
R11L  62.87,9.84 90 top
R11N  63.5,82.23 270 top
R12L  95.57,2.06 270 top
R13L  95.56,8.73 90 top
R30  85.09,15.56 0 top
R30P  89.06,11.75 270 top
R31  23.5,15.56 0 top
R31P  27.46,11.75 270 top
R32  145.1,15.56 0 top
R32P  149.07,11.75 270 top
R40  113.67,15.56 0 top
R40P  117.63,11.75 270 top
R50  53.02,15.56 0 top
R50P  56.99,11.75 270 top
RESET  55.24,3.81 0 top
U01  113.67,5.08 0 top
U10  69.85,5.08 270 top
U11  94.93,5.4 270 top
U30  85.09,12.38 0 top
U31  23.5,12.38 0 top
U32  145.1,12.38 0 top
U40  113.67,12.38 0 top
U50  53.02,12.38 0 top
Z01  122.56,14.61 0 top
Z02  119.06,8.89 0 top
Z10U  101.82,7.36 180 top
Z11U  101.9,3.55 180 top

### Tracks (layer width: path | path; a pad name or v marks a point on that pad's centre or on a via)
!RST  (via drill 0.25 pad 0.7)
  Top 0.203: RESET.2 59.96,3.81 C10R.1 60.8,4.65 v60.8,5.4 | U10.4 66.06,6.05 v66.04,6.03
  Route2 0.254: v60.8,5.4 65.41,5.4 v66.04,6.03
A  (via drill 0.25 pad 0.7)
  Top 0.203: Z11U.2 101.44,3.55 v101.44,3.49
  Top 0.254: J11B.A6 32.77,12.31 v32.38,12.7
  Top 0.305: U11.6 97.61,5.07 R10T.1 | J10B.A6 126.75,12.31 v126.36,12.7
  Top 0.762: R10T.1 99.17,4.58 Z11U.2
  Bottom 0.254: v32.38,12.7 33.18,11.91 41.27,11.91 45.4,7.78 95.09,7.78 99.38,3.49 v101.44,3.49 102.23,3.49 103.98,5.24 113.82,5.24 121.28,12.7 v126.36,12.7
B  (via drill 0.25 pad 0.7)
  Top 0.203: v101.6,5.71 100.03,7.28
  Top 0.254: J11B.A7 33.27,12.31 v33.66,12.7
  Top 0.305: U11.7 97.61,5.72 R10T.2 | J10B.A7 127.25,12.31 v127.64,12.7
  Top 0.762: R10T.2 98.97,6.22 100.03,7.28 Z10U.2
  Bottom 0.254: v33.66,12.7 33.97,12.38 41.59,12.38 45.72,8.26 95.25,8.26 97.79,5.71 v101.6,5.71 113.67,5.71 121.44,13.49 126.84,13.49 v127.64,12.7
DIR_485  (via drill 0.25 pad 0.7)
  Top 0.203: U11.3 U11.2 | U11.3 v92.4,5.07 v92.39,5.08 | U11.3 94.61,5.08 94.61,2.22 94.46,2.06 92.23,2.06 90.81,0.64 73.66,0.64 72.77,1.53 U10.11
DRED_PWM0  (via drill 0.25 pad 0.7)
  Top 0.203: R30P.1 | U10.7 68.6,4.11 v68.9,3.81
  Top 0.305: v90.65,9.37 90.65,11.91 89.98,12.57 R30P.1
  Route15 0.254: v68.9,3.81 69.53,3.17 84.45,3.17 v90.65,9.37
DRED_PWM1  (via drill 0.25 pad 0.7)
  Top 0.203: 27.47,12.7 R31P.1
  Top 0.254: 27.47,12.7 28.57,11.59 28.57,10.64 26.35,8.41 26.35,1.91 27.62,0.64 64.77,0.64 66.29,2.15 U10.10
  Top 0.762: 27.47,12.7 v27.47,13.49 v27.46,13.49
DRED_PWM2  (via drill 0.25 pad 0.7)
  Top 0.203: R32P.1 | U10.12 74.03,2.81 v75.25,1.59
  Top 0.762: R32P.1 v149.07,13.49
  Route15 0.254: v75.25,1.59 75.88,0.95 142.24,0.95 149.07,7.78 v149.07,13.49
FRED_PWM0  (via drill 0.25 pad 0.7)
  Top 0.203: U10.14 71.46,4.11 v71.44,4.13
  Top 0.762: R50P.1 v56.99,13.49
  Route15 0.254: v71.44,4.13 67.31,8.26 62.23,8.26 v56.99,13.49
GND  (via drill 0.25 pad 0.7, 0.8 pad 1.5)  (1 unrouted)
  Top 0.305: J10B.A1 124.25,10.27 124.14,10.16 | J10B.A12 129.75,10.27 129.86,10.16 | J11B.A1 30.27,10.27 30.16,10.16 | J11B.A12 35.77,10.27 35.88,10.16
  Top 0.508: R11N.1 64.58,83.05 64.77,82.87 64.77,18.1
  other vias: 66.99,13.18 72.71,13.18 64.77,16.51
  pour Top (rank 2): 0,0 0.64,17.47 160.67,17.47 160.03,0
  pour Route15: 0,0 0,17.46 160.02,17.46 160.02,0
  pour Bottom: 0,0 0,17.46 160.02,17.46 160.02,0
LED_GRN
  Top 0.203: R11L.1 64.11,7.78 65.41,7.78 65.72,7.46 65.72,6.99 66,6.71 U10.3
LED_RED
  Top 0.203: R10L.1 66.04,8.07 66.04,7.62 66.31,7.36 U10.2
N$1
  Top 0.508: LD31B1.A LD30B1.C
N$2
  Top 0.508: LD32B1.A LD31B1.C
N$3
  Top 0.762: LD02-G.A R02L.2
N$4
  Top 0.508: LD33B1.A LD32B1.C
N$5
  Top 0.508: LD34B1.A LD33B1.C
N$6
  Top 0.508: LD35B1.A LD34B1.C
N$7
  Top 0.508: LD35B1.C LD36B1.A
N$8
  Top 0.508: LD31B4.A LD30B4.C
N$9
  Top 0.508: LD32B4.A LD31B4.C
N$10
  Top 0.508: LD33B4.A LD32B4.C
N$11
  Top 0.508: LD34B4.A LD33B4.C
N$12
  Top 0.508: U30.3 87.41,10.98 C30P.1
  Top 0.762: R30P.2 C30P.1
N$13
  Top 0.508: LD35B4.A LD34B4.C
N$14
  Top 0.508: LD36B4.A LD35B4.C
N$15
  Top 0.508: LD30DR.A LD30DR1.C
N$16
  Top 0.508: LD30DR1.A LD30DR2.C
N$17
  Top 0.508: LD30DR2.A LD30DR3.C
N$18
  Top 0.508: LD30DR4.C LD30DR3.A
N$19
  Top 0.508: LD30DR5.C LD30DR4.A
N$20
  Top 0.508: LD30DR5.A LD30DR6.C
N$21
  Top 0.508: LD30DR7.C LD30DR6.A
N$22
  Top 0.508: LD30DR8.C LD30DR7.A
N$23
  Top 0.508: LD30DR9.C LD30DR8.A
N$24
  Top 0.508: LD30DR9.A LD30DR10.C
N$25
  Top 0.762: LD01-G.A R01L.2
N$26
  Top 0.508: LD30DR11.A LD30DR12.C
N$27
  Top 0.508: LD30DR12.A LD30DR13.C
N$28
  Top 0.508: LD30DR14.C LD30DR13.A
N$29
  Top 0.508: LD30DR14.A LD30DR15.C
N$30
  Top 0.508: LD30DR15.A LD30DR16.C
N$31
  Top 0.508: LD30DR17.C LD30DR16.A
N$32
  Top 0.508: LD30DR18.C LD30DR17.A
N$33
  Top 0.508: LD30DR18.A LD30DR19.C
N$34
  Top 0.508: LD30DR19.A LD30DR20.C
N$35
  Top 0.508: LD30DR21.C LD30DR20.A
N$36
  Top 0.508: LD30DR22.A LD30DR23.C
N$37
  Top 0.508: LD30DR24.C LD30DR23.A
N$38
  Top 0.508: LD30DR24.A LD30DR25.C
N$39
  Top 0.508: LD30DR26.C LD30DR25.A
N$40
  Top 0.508: LD30DR26.A LD30DR27.C
N$41
  Top 0.508: LD30DR28.C LD30DR27.A
N$42
  Top 0.508: LD30DR29.C LD30DR28.A
N$43
  Top 0.508: LD30DR30.C LD30DR29.A
N$44
  Top 0.508: LD30DR30.A LD30DR31.C
N$45
  Top 0.508: LD30DR32.C LD30DR31.A
N$46
  Top 0.508: LD30DR33.A LD30DR34.C
N$47
  Top 0.508: LD30DR35.C LD30DR34.A
N$48
  Top 0.508: LD30DR36.C LD30DR35.A
N$49
  Top 0.305: LD30DR36.A LD30DR37.C
N$50
  Top 0.305: LD30DR37.A LD30DR38.C
N$51
  Top 0.305: LD30DR38.A LD30DR39.C
N$52
  Top 0.305: LD30DR39.A LD30DR40.C
N$53
  Top 0.305: LD30DR40.A LD30DR41.C
N$54
  Top 0.305: LD30DR41.A LD30DR42.C
N$55
  Top 0.305: LD30DR42.A LD30DR43.C
N$56
  Top 0.508: LD30DR44.A LD30DR45.C
N$57
  Top 0.508: LD30DR46.C LD30DR45.A
N$58
  Top 0.508: LD30DR46.A LD30DR47.C
N$59
  Top 0.305: LD30DR47.A LD30DR48.C
N$60
  Top 0.305: LD30DR48.A LD30DR49.C
N$61
  Top 0.305: LD30DR49.A LD30DR50.C
N$62
  Top 0.305: LD30DR50.A LD30DR51.C
N$63
  Top 0.305: LD30DR51.A LD30DR52.C
N$64
  Top 0.305: LD30DR52.A LD30DR53.C
N$65
  Top 0.305: LD30DR53.A LD30DR54.C
N$66
  Top 0.508: LD30DR55.A LD30DR56.C
N$67
  Top 0.508: LD30DR56.A LD30DR57.C
N$68
  Top 0.508: LD30DR58.C LD30DR57.A
N$69
  Top 0.305: LD30DR58.A LD30DR59.C
N$70
  Top 0.305: LD30DR59.A LD30DR60.C
N$71
  Top 0.305: LD30DR60.A LD30DR61.C
N$72
  Top 0.305: LD30DR61.A LD30DR62.C
N$73
  Top 0.305: LD30DR62.A LD30DR63.C
N$74
  Top 0.305: LD30DR63.A LD30DR64.C
N$75
  Top 0.305: LD30DR64.A LD30DR65.C
N$76
  Top 0.508: LD30DR67.C LD30DR66.A
N$77
  Top 0.508: LD30DR68.C LD30DR67.A
N$78
  Top 0.508: LD30DR69.C LD30DR68.A
N$79
  Top 0.508: LD30DR70.C LD30DR69.A
N$80
  Top 0.508: LD30DR71.C LD30DR70.A
N$81
  Top 0.508: LD30DR72.C LD30DR71.A
N$82
  Top 0.508: LD30DR73.C LD30DR72.A
N$83
  Top 0.508: LD30DR74.C LD30DR73.A
N$84
  Top 0.508: LD30DR75.C LD30DR74.A
N$85
  Top 0.508: LD30DR76.C LD30DR75.A
N$86
  Top 0.508: LD30DR78.C LD30DR77.A
N$87
  Top 0.508: LD30DR79.C LD30DR78.A
N$88
  Top 0.508: LD30DR80.C LD30DR79.A
N$89
  Top 0.508: LD30DR81.C LD30DR80.A
N$90
  Top 0.508: LD30DR82.C LD30DR81.A
N$91
  Top 0.508: LD30DR83.C LD30DR82.A
N$92
  Top 0.508: LD30DR84.C LD30DR83.A
N$93
  Top 0.508: LD30DR85.C LD30DR84.A
N$94
  Top 0.508: LD30DR86.C LD30DR85.A
N$95
  Top 0.508: LD30DR87.C LD30DR86.A
N$96
  Top 0.508: LD30DR89.C LD30DR88.A
N$97
  Top 0.508: LD30DR90.C LD30DR89.A
N$98
  Top 0.508: LD30DR91.C LD30DR90.A
N$99
  Top 0.508: LD30DR92.C LD30DR91.A
N$100
  Top 0.508: LD30DR93.C LD30DR92.A
N$101
  Top 0.508: LD30DR94.C LD30DR93.A
N$102
  Top 0.508: LD30DR95.C LD30DR94.A
N$103
  Top 0.508: LD30DR96.C LD30DR95.A
N$104
  Top 0.508: LD30DR97.C LD30DR96.A
N$105
  Top 0.508: LD30DR98.C LD30DR97.A
N$106
  Top 0.508: LD41B.A LD40B.C
N$107
  Top 0.508: LD41B.C LD42B.A
N$108
  Top 0.508: LD42B.C LD43B.A
N$109
  Top 0.508: LD43B.C LD44B.A
N$110
  Top 0.508: LD44B.C LD45B.A
N$111
  Top 0.508: LD45B.C LD46B.A
N$112
  Top 0.508: LD30B3.C LD31B3.A
N$113
  Top 0.508: LD32B3.A LD31B3.C
N$114
  Top 0.508: LD33B3.A LD32B3.C
N$115
  Top 0.508: LD34B3.A LD33B3.C
N$116
  Top 0.508: LD35B3.A LD34B3.C
N$117
  Top 0.508: LD36B3.A LD35B3.C
N$118
  Top 0.508: LD51FR.C LD50FR.A
N$119
  Top 0.508: LD52FR.C LD51FR.A
N$120
  Top 0.508: LD53FR.C LD52FR.A
N$121
  Top 0.508: LD54FR.C LD53FR.A
N$122
  Top 0.508: LD55FR.C LD54FR.A
N$123
  Top 0.508: LD56FR.C LD55FR.A
N$124
  Top 0.508: LD57FR.C LD56FR.A
N$125
  Top 0.508: LD58FR.C LD57FR.A
N$126
  Top 0.508: LD59FR.C LD58FR.A
N$127
  Top 0.508: LD5AFR.C LD59FR.A
N$128
  Top 0.508: LD51FR1.C LD50FR1.A
N$129
  Top 0.508: LD52FR1.C LD51FR1.A
N$130
  Top 0.508: LD53FR1.C LD52FR1.A
N$131
  Top 0.508: LD54FR1.C LD53FR1.A
N$132
  Top 0.508: LD55FR1.C LD54FR1.A
N$133
  Top 0.508: LD56FR1.C LD55FR1.A
N$134
  Top 0.508: LD57FR1.C LD56FR1.A
N$135
  Top 0.508: LD58FR1.C LD57FR1.A
N$136
  Top 0.508: LD59FR1.C LD58FR1.A
N$137
  Top 0.508: LD5AFR1.C LD59FR1.A
N$138  (1 unrouted)
  Top 0.762: LD30DR21.A 67.34,161 66.36,160.02 66.36,18.1
  Top 1.524: H5.1 74.52,14.38 L30.1 | LD30DR21.A LD30DR10.A LD30DR32.A
N$139  (1 unrouted)
  Top 0.508: U31.4 24.45,15.43 R31.2
  Top 0.762: R31.2 H8.1
  Top 1.016: LD30DR33.C LD30DR44.C LD30DR55.C
N$140
  Top 0.508: U30.1 82.53,10.98 D30.2
  Top 0.762: D30.2 77.77,10.68 L30.2
N$141  (1 unrouted)
  Top 0.508: U30.4 86.04,15.43 R30.2
  Top 0.762: R30.2 H6.1
  Top 1.016: LD30DR11.C LD30DR.C LD30DR22.C
N$142  (1 unrouted)
  Top 0.762: LD30DR43.A 7.96,161 6.99,160.02
  Top 1.524: H7.1 12.7,14.61 15.65,14.61 L31.1 | LD30DR43.A LD30DR54.A LD30DR65.A
N$143  (1 unrouted)
  Top 0.508: U32.4 146.05,15.43 R32.2
  Top 0.762: H10.1 R32.2
  Top 1.016: LD30DR66.C LD30DR77.C LD30DR88.C
N$144  (2 unrouted)
  Top 0.762: LD30DR76.A 127.66,161 127,160.34 127,18.1
  Top 1.524: H9.1 134.3,14.61 137.48,14.61 L32.1 | LD30DR76.A LD30DR87.A
N$145  (2 unrouted)
  Top 0.305: LD46B.C 44.53,19.14 44.77,19.37 54.93,19.37 55.24,19.05 59.91,19.05 LD36B3.C | LD36B1.C 100.01,19.14 100.1,19.05
  Top 0.508: LD36B4.C 114.7,19.14 113.03,17.46 105.41,17.46 103.82,19.05 99.92,19.05 | 99.69,19.05 99.92,19.05 | 99.92,19.05 LD36B1.C
  Top 1.524: H11.1 102.87,14.61 105.82,14.61 L40.1
  Route15 0.762: H15.1 63.82,11.75 98.11,11.75 H11.1
N$146  (1 unrouted)
  Top 0.508: U40.4 114.61,15.55 114.62,15.56 | LD40B.A 44.38,162 46.83,159.54 54.77,159.54 57.23,162 LD30B3.A 62.94,162 64.77,163.83 95.57,163.83 97.4,162 LD30B1.A 103.43,162 105.89,159.54 114.46,159.54 116.92,162 LD30B4.A
  Top 0.762: R40.2 114.62,15.56 H12.1 | LD30B4.A 122.16,162 123.19,160.97 123.19,18.1
  Top 1.524: H12.1 116.84,15.88 116.84,15.56
N$147
  Top 0.508: U31.1 20.94,10.98 D31.2
  Top 0.762: D31.2 16.18,10.68 L31.2
N$148
  Top 0.762: LD11-G.A R11L.2
N$149
  Top 0.762: LD10-R.A R10L.2
N$150  (2 unrouted)
  Top 0.305: LD50FR1.C 108.82,18.5 106.68,20.64 96.52,20.64
  Top 0.508: U50.4 53.97,15.55 53.98,15.56
  Top 0.762: R50.2 53.98,15.56 H14.1
  Bottom 0.762: H14.1 56.83,15.56 60.64,11.75 91.76,11.75 H16.1
N$151
  Top 1.27: D01.C Z01.2
N$152
  Top 0.762: LD13G.A R13L.2
N$153
  Top 0.762: LD12R.A R12L.2
N$154
  Top 0.508: U31.3 25.82,10.98 C31P.1
  Top 0.762: R31P.2 C31P.1
N$155
  Top 0.508: U32.1 142.54,10.98 D32.2
  Top 0.762: D32.2 137.78,10.68 L32.2
N$156
  Top 0.508: U32.3 147.58,10.98 147.64,10.93
  Top 0.762: R32P.2 147.64,10.93 C32P.1
N$157
  Top 0.508: U50.1 50.47,10.98 D50.2
  Top 0.762: D50.2 45.7,10.68 L50.2
N$158
  Top 0.508: U50.3 55.35,10.98 C50P.1
  Top 0.762: R50P.2 C50P.1
N$159  (1 unrouted)
  Top 0.508: LD5AFR.A 50,161.77
  Top 0.762: LD5AFR1.A 110,165.59 107.63,167.96 49.85,167.96 | 49.85,167.96 37.78,167.96 35.24,165.42 35.24,18.1 | LD5AFR.A 50,167.81 49.85,167.96
  Top 1.524: H13.1 42.23,14.61 42.55,14.61 42.77,14.38 L50.1
N$160
  Top 0.508: 110.95,10.82 D40.2 111.11,10.98 U40.1
  Top 0.762: D40.2 106.34,10.68 L40.2
N$161
  Top 0.508: U40.3 115.99,10.98 C40P.1
  Top 0.762: R40P.2 C40P.1
N$162
  Top 1.016: Z02.2 120.76,14.51 Z01.1
RBLU_PWM0  (via drill 0.25 pad 0.7)
  Top 0.203: R40P.1 | U10.13 75.28,3.46 v76.52,2.22
  Top 0.762: R40P.1 v117.63,13.49
  Route15 0.254: v76.52,2.22 76.83,1.91 111.76,1.91 117.63,7.78 v117.63,13.49
RXD_232
  Top 0.203: U10.9 66.31,2.81 64.61,1.11 42.23,1.11 41.91,1.43 J10S.1
RXD_485
  Top 0.203: U11.1 93.51,6.35 89.22,6.35 88.74,6.83 73.66,6.83 73.54,6.71 U10.18
  Top 0.305: LD13G.C 93.66,6.5 U11.1
SWD_CLK
  Top 0.203: U10.20 72.77,9.78 72.39,10.16 68.9,10.16 68.58,9.84 68.58,9.27 J10P.3
SWDIO
  Top 0.203: U10.19 72.02,7.36 71,8.38 J10P.1
TEMP  (via drill 0.25 pad 0.7, 0.8 pad 1.5)  (1 unrouted)
  Top 0.254: U10.6 67.94,4.75 v68.26,5.08 | R10N.1 61.75,6.83 61.28,7.3 61.28,14.29 62.87,15.88 v62.87,16.51
  Top 0.508: R11N.2 63.5,18.1
  Route2 0.254: v68.26,5.08 68.26,6.67 67.63,7.3 63.79,7.3 R10N.1
  other vias: 63.31,6.83
TXD_232
  Top 0.203: U10.8 66.32,3.46 64.45,1.59 44.77,1.59 44.45,1.91 J10S.2
TXD_485
  Top 0.203: U10.17 73.52,6.05 73.82,6.35 87.95,6.35 89.88,4.42 U11.4
  Top 0.305: U11.4 93.66,4.42 LD12R.C
VCC
  Top 0.305: U01.1 112.72,4.76 113.03,5.08 114.3,5.08 114.61,5.39 U01.4 116.05,6.48 R01L.1
  Top 0.508: U01.1 112.72,2.28 C01.1
  Top 0.762: R01L.1 116.52,6.95 116.52,8.05 Z02.1
VCCA
  Top 0.203: 66.94,5.4 U10.5
  Top 0.254: L10.2 U10.5 67.3,5.41 67.31,5.4
  Top 0.305: R10N.2 64.96,5.53 65.09,5.4 L10.2
VDD_3V3  (via drill 0.25 pad 0.7)
  Top 0.254: R02L.1 110.81,6.95
  Top 0.305: U01.5 111.26,6.48 R02L.1 | C11D.1 v74.3,5.4 74.29,5.41 U10.16 | U11.8 96.33,7.13 R13L.1
  Top 0.508: U01.5 v112.71,7.46 112.71,8.13 C02.1
  Top 0.762: R13L.1 C12D.1 97.18,7.94 v98.11,7.94 | R12L.1 96.49,2.88 v96.52,2.86 | C10D.1 63.31,4.58 v63.34,4.6 63.31,4.63 L10.1
  pour Route2: 0,0 0,8.26 160.02,8.26 160.02,0
VDD_24V  (via drill 0.25 pad 0.7)
  Top 0.305: J10B.A9 128.25,10.21 J10B.B4 | J10B.A4 125.75,10.21 J10B.B9 | J11B.A9 34.27,10.21 J11B.B4 | J11B.A4 31.77,10.21 J11B.B9
  Top 0.508: D31.1- 20.94,13.78 U31.5 22.55,15.56 R31.1 | D50.1- 50.47,13.78 U50.5 52.07,15.43 R50.1 | D32.1- 142.54,13.78 U32.5 144.15,15.56 | D40.1- 111.11,13.78 U40.5 112.71,15.56 | D30.1- 82.53,13.78 U30.5 84.14,15.43 R30.1
  Top 0.762: C32D.1 v143.67,15.56 144.15,15.56 R32.1 | C30D.1 v83.66,15.56 84.01,15.56 84.14,15.43 | C40D.1 v112.24,15.56 112.71,15.56 R40.1 | C31D.1 v22.07,15.56 22.55,15.56 | C50D.1 v51.59,15.56 51.95,15.56 52.07,15.43
  Top 1.016: D01.A v129.86,14.61
  Route2 0.508: 128.2,11.43 J10B.B4 | J10B.B9 125.8,11.34 | J11B.B9 31.82,11.36 | J11B.B4 34.22,11.36
  pour Route2: 0,8.89 0,17.46 160.02,17.46 160.02,8.89

### Text on the board
Top: 1
tPlace: SUN-SIM v1.0 | 180528
tDocu: 180 MM | 170 MM | 150 MM | 160 MM